# EAGLE design passion-v2-1 (EAGLE 9.6.2)
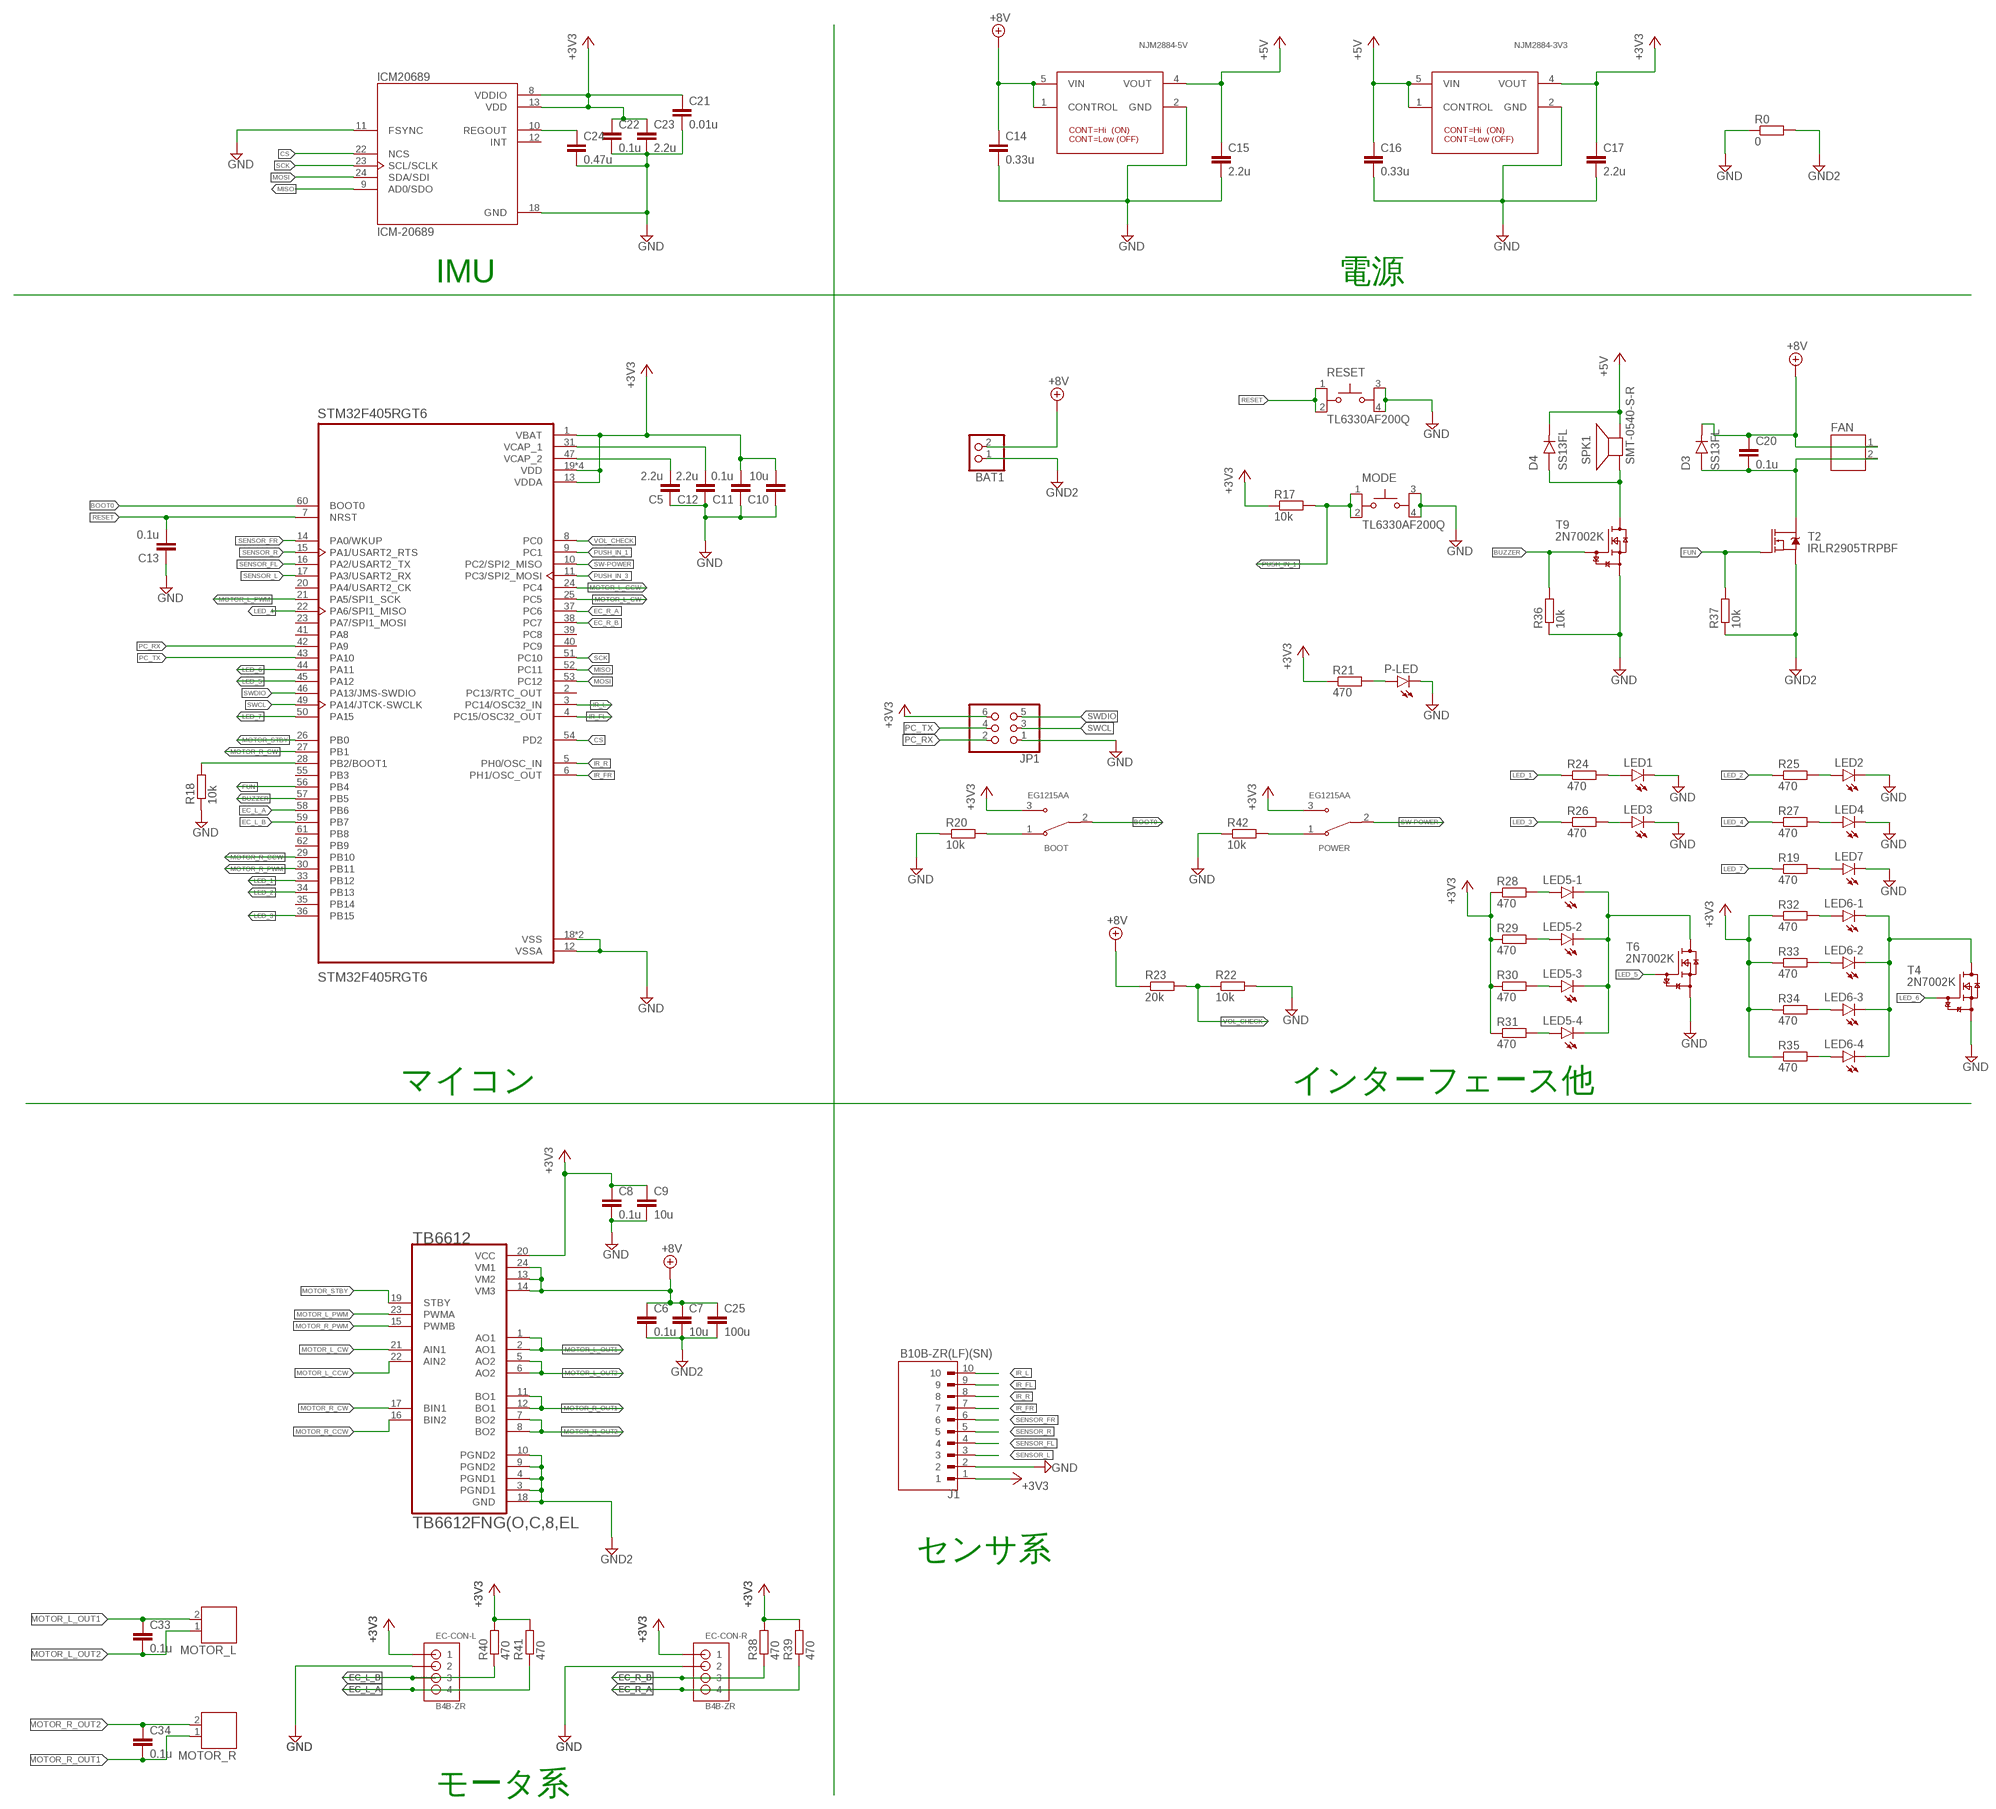
[diagram p0: schematic, sheet 1]

## Parts
BAT1  PINHD-1X2  [1X02]
BOOT  EG1215AA  [SW_EG1215AA]
C5  2.2u  C-EUC0603  [C0603]
C6  0.1u  C-EUC0603  [C0603]
C7  10u  C-EUC0603  [C0603]
C8  0.1u  C-EUC0603  [C0603]
C9  10u  C-EUC0603K  [C0603K]
C10  10u  C-EUC0603  [C0603]
C11  0.1u  C-EUC0603  [C0603]
C12  2.2u  C-EUC0603  [C0603]
C13  0.1u  C-EUC0603  [C0603]
C14  0.33u  C-EUC0603  [C0603]
C15  2.2u  C-EUC0603  [C0603]
C16  0.33u  C-EUC0603  [C0603]
C17  2.2u  C-EUC0603  [C0603]
C20  0.1u  C-EUC0603  [C0603]
C21  0.01u  C-EUC0603  [C0603]
C22  0.1u  C-EUC0603  [C0603]
C23  2.2u  C-EUC0603  [C0603]
C24  0.47u  C-EUC0603  [C0603]
C25  100u  C-EUC3216  [C3216]
C33  0.1u  C-EUC0603  [C0603]
C34  0.1u  C-EUC0603  [C0603]
D3  SS13FL  [SODFL3617X108N]
D4  SS13FL  [SODFL3617X108N]
EC-CON-L  B4B-ZR  [B4B-ZR]
EC-CON-R  B4B-ZR  [B4B-ZR]
FAN  JST-PH2  [JST-PH2]
ICM20689  ICM-20689  [QFN50P400X400X95-24N]
J1  B10B-ZR(LF)(SN)  [JST_B10B-ZR(LF)(SN)]
JP1  PINHD-2X3  [2X03]
LED1  LEDCHIPLED_0603  [CHIPLED_0603]
LED2  LEDCHIPLED_0603  [CHIPLED_0603]
LED3  LEDCHIPLED_0603  [CHIPLED_0603]
LED4  LEDCHIPLED_0603  [CHIPLED_0603]
LED5-1  LEDCHIPLED_0603  [CHIPLED_0603]
LED5-2  LEDCHIPLED_0603  [CHIPLED_0603]
LED5-3  LEDCHIPLED_0603  [CHIPLED_0603]
LED5-4  LEDCHIPLED_0603  [CHIPLED_0603]
LED6-1  LEDCHIPLED_0603  [CHIPLED_0603]
LED6-2  LEDCHIPLED_0603  [CHIPLED_0603]
LED6-3  LEDCHIPLED_0603  [CHIPLED_0603]
LED6-4  LEDCHIPLED_0603  [CHIPLED_0603]
LED7  LEDCHIPLED_0603  [CHIPLED_0603]
MODE  TL6330AF200Q  [SW_TL6330AF200Q]
MOTOR_L  JST-PH2  [JST-PH2]
MOTOR_R  JST-PH2  [JST-PH2]
NJM2884-3V3  I-10673_NJM2884U1-33  [NJM2884U1-33]
NJM2884-5V  I-10673_NJM2884U1-33  [NJM2884U1-33]
P-LED  LEDCHIPLED_0603  [CHIPLED_0603]
POWER  EG1215AA  [SW_EG1215AA]
R0  0  R-EU_R0603  [R0603]
R17  10k  R-EU_R0603  [R0603]
R18  10k  R-EU_R0603  [R0603]
R19  470  R-EU_R0603  [R0603]
R20  10k  R-EU_R0603  [R0603]
R21  470  R-EU_R0603  [R0603]
R22  10k  R-EU_R0603  [R0603]
R23  20k  R-EU_R0603  [R0603]
R24  470  R-EU_R0603  [R0603]
R25  470  R-EU_R0603  [R0603]
R26  470  R-EU_R0603  [R0603]
R27  470  R-EU_R0603  [R0603]
R28  470  R-EU_R0603  [R0603]
R29  470  R-EU_R0603  [R0603]
R30  470  R-EU_R0603  [R0603]
R31  470  R-EU_R0603  [R0603]
R32  470  R-EU_R0603  [R0603]
R33  470  R-EU_R0603  [R0603]
R34  470  R-EU_R0603  [R0603]
R35  470  R-EU_R0603  [R0603]
R36  10k  R-EU_R0603  [R0603]
R37  10k  R-EU_R0603  [R0603]
R38  470  R-EU_R0402  [R0402]
R39  470  R-EU_R0402  [R0402]
R40  470  R-EU_R0402  [R0402]
R41  470  R-EU_R0402  [R0402]
R42  10k  R-EU_R0603  [R0603]
RESET  TL6330AF200Q  [SW_TL6330AF200Q]
SPK1  SMT-0540-S-R  [SMT-0540-S-R]
STM32F405RGT6  STM32F405RGT6  [QFP50P1200X1200X160-64N]
T2  IRLR2905TRPBF  [TO252-3]
T4  2N7002K  [SOT23]
T6  2N7002K  [SOT23]
T9  2N7002K  [SOT23]
TB6612  TB6612FNG(O,C,8,EL  [SOP65P760X160-24N]

## Nets
+3V3 [power]: BOOT.3 C8.1 C9.1 C10.2 C11.2 C17.1 C21.1 C22.1 C23.1 EC-CON-L.1 EC-CON-R.1 ICM20689.8(VDDIO) ICM20689.13(VDD) J1.1 JP1.6 NJM2884-3V3.4(VOUT) POWER.3 R17.1 R21.1 R28.1 R29.1 R30.1 R31.1 R32.1 R33.1 R34.1 R35.1 R38.2 R39.2 R40.2 R41.2 STM32F405RGT6.1(VBAT) STM32F405RGT6.13(VDDA) STM32F405RGT6.19(VDD) STM32F405RGT6.32(VDD) STM32F405RGT6.48(VDD) STM32F405RGT6.64(VDD) TB6612.20(VCC)
+5V [power]: C15.1 C16.1 D4.C NJM2884-3V3.1(CONTROL) NJM2884-3V3.5(VIN) NJM2884-5V.4(VOUT) SPK1.+(-)
+8V [motor]: BAT1.2 C6.1 C7.1 C14.1 C20.1 C25.1 D3.C FAN.1 NJM2884-5V.1(CONTROL) NJM2884-5V.5(VIN) R23.1 TB6612.13(VM2) TB6612.14(VM3) TB6612.24(VM1)
BOOT0: BOOT.2 STM32F405RGT6.60(BOOT0)
BUZZER: R36.2 STM32F405RGT6.57(PB5) T9.1(G)
CS: ICM20689.22(NCS) STM32F405RGT6.54(PD2)
EC_L_A: EC-CON-L.4 R41.1 STM32F405RGT6.58(PB6)
EC_L_B: EC-CON-L.3 R40.1 STM32F405RGT6.59(PB7)
EC_R_A: EC-CON-R.4 R39.1 STM32F405RGT6.37(PC6)
EC_R_B: EC-CON-R.3 R38.1 STM32F405RGT6.38(PC7)
FUN: R37.2 STM32F405RGT6.56(PB4) T2.1(G)
GND [motor]: C5.1 C8.2 C9.2 C10.1 C11.1 C12.1 C13.1 C14.2 C15.2 C16.2 C17.2 C21.2 C22.2 C23.2 C24.2 EC-CON-L.2 EC-CON-R.2 ICM20689.11(FSYNC) ICM20689.18(GND) J1.2 JP1.1 LED1.C LED2.C LED3.C LED4.C LED7.C MODE.3 MODE.4 NJM2884-3V3.2(GND) NJM2884-5V.2(GND) P-LED.C R0.1 R18.1 R20.1 R22.2 R36.1 R42.1 RESET.3 RESET.4 STM32F405RGT6.12(VSSA) STM32F405RGT6.18(VSS) STM32F405RGT6.63(VSS) T4.2(S) T6.2(S) T9.2(S)
GND2 [motor]: BAT1.1 C6.2 C7.2 C25.2 R0.2 R37.1 T2.3(S) TB6612.3(PGND1) TB6612.4(PGND1) TB6612.9(PGND2) TB6612.10(PGND2) TB6612.18(GND)
IR_FL: J1.9 STM32F405RGT6.4(PC15/OSC32_OUT)
IR_FR: J1.7 STM32F405RGT6.6(PH1/OSC_OUT)
IR_L: J1.10 STM32F405RGT6.3(PC14/OSC32_IN)
IR_R: J1.8 STM32F405RGT6.5(PH0/OSC_IN)
LED_1: R24.1 STM32F405RGT6.33(PB12)
LED_2: R25.1 STM32F405RGT6.34(PB13)
LED_3: R26.1 STM32F405RGT6.36(PB15)
LED_4: R27.1 STM32F405RGT6.22(PA6/SPI1_MISO)
LED_5: STM32F405RGT6.45(PA12) T6.1(G)
LED_6: STM32F405RGT6.44(PA11) T4.1(G)
LED_7: R19.1 STM32F405RGT6.50(PA15)
MISO: ICM20689.9(AD0/SDO) STM32F405RGT6.52(PC11)
MOSI: ICM20689.24(SDA/SDI) STM32F405RGT6.53(PC12)
MOTOR_L_CCW: STM32F405RGT6.24(PC4) TB6612.22(AIN2)
MOTOR_L_CW: STM32F405RGT6.25(PC5) TB6612.21(AIN1)
MOTOR_L_OUT1 [motor]: C33.1 MOTOR_L.2 TB6612.1(AO1) TB6612.2(AO1)
MOTOR_L_OUT2 [motor]: C33.2 MOTOR_L.1 TB6612.5(AO2) TB6612.6(AO2)
MOTOR_L_PWM: STM32F405RGT6.21(PA5/SPI1_SCK) TB6612.23(PWMA)
MOTOR_R_CCW: STM32F405RGT6.29(PB10) TB6612.16(BIN2)
MOTOR_R_CW: STM32F405RGT6.27(PB1) TB6612.17(BIN1)
MOTOR_R_OUT1 [motor]: C34.2 MOTOR_R.1 TB6612.11(BO1) TB6612.12(BO1)
MOTOR_R_OUT2 [motor]: C34.1 MOTOR_R.2 TB6612.7(BO2) TB6612.8(BO2)
MOTOR_R_PWM: STM32F405RGT6.30(PB11) TB6612.15(PWMB)
MOTOR_STBY: STM32F405RGT6.26(PB0) TB6612.19(STBY)
N$13: C5.2 STM32F405RGT6.47(VCAP_2)
N$14: C12.2 STM32F405RGT6.31(VCAP_1)
N$15 [motor]: R18.2 STM32F405RGT6.28(PB2/BOOT1)
N$16: LED5-2.A R29.2
N$17: LED5-3.A R30.2
N$18: LED5-4.A R31.2
N$19: BOOT.1 R20.2
N$20: C24.1 ICM20689.10(REGOUT)
N$21: P-LED.A R21.2
N$22: C20.2 D3.A FAN.2 T2.2(D) T2.PAD(D)
N$23: D4.A SPK1.-(+) T9.3(D)
N$26: LED6-2.A R33.2
N$27: LED1.A R24.2
N$28: LED6-3.A R34.2
N$29: LED6-4.A R35.2
N$30: POWER.1 R42.2
N$31: LED4.A R27.2
N$32: LED5-1.A R28.2
N$33: LED7.A R19.2
N$36: LED2.A R25.2
N$38 [motor]: LED6-1.C LED6-2.C LED6-3.C LED6-4.C T4.3(D)
N$39 [motor]: LED5-1.C LED5-2.C LED5-3.C LED5-4.C T6.3(D)
N$41: LED3.A R26.2
N$43: LED6-1.A R32.2
PC_RX: JP1.2 STM32F405RGT6.42(PA9)
PC_TX: JP1.4 STM32F405RGT6.43(PA10)
PUSH_IN_1: MODE.1 MODE.2 R17.2 STM32F405RGT6.9(PC1)
PUSH_IN_3: STM32F405RGT6.11(PC3/SPI2_MOSI)
RESET: C13.2 RESET.1 RESET.2 STM32F405RGT6.7(NRST)
SCK: ICM20689.23(SCL/SCLK) STM32F405RGT6.51(PC10)
SENSOR_FL: J1.4 STM32F405RGT6.16(PA2/USART2_TX)
SENSOR_FR: J1.6 STM32F405RGT6.14(PA0/WKUP)
SENSOR_L: J1.3 STM32F405RGT6.17(PA3/USART2_RX)
SENSOR_R: J1.5 STM32F405RGT6.15(PA1/USART2_RTS)
SW-POWER: POWER.2 STM32F405RGT6.10(PC2/SPI2_MISO)
SWCL: JP1.3 STM32F405RGT6.49(PA14/JTCK-SWCLK)
SWDIO: JP1.5 STM32F405RGT6.46(PA13/JMS-SWDIO)
VOL_CHECK: R22.1 R23.2 STM32F405RGT6.8(PC0)
Unconnected: ICM20689.12(INT) STM32F405RGT6.2(PC13/RTC_OUT) STM32F405RGT6.20(PA4/USART2_CK) STM32F405RGT6.23(PA7/SPI1_MOSI) STM32F405RGT6.35(PB14) STM32F405RGT6.39(PC8) STM32F405RGT6.40(PC9) STM32F405RGT6.41(PA8) STM32F405RGT6.55(PB3) STM32F405RGT6.61(PB8) STM32F405RGT6.62(PB9)

## Notes on the sheet
- IMU | 電源
- マイコン | インターフェース他
- センサ系
- モータ系

## Library data of the parts
BAT1 = pinhead:PINHD-1X2: PIN HEADER
BOOT POWER = EG1215AA:EG1215AA: Slide Switch SPDT Surface Mount, Right Angle Check availability <https://pricing.snapeda.com/parts/EG1215AA/E-Switch/view-part?ref=eda>; AVAILABILITY: In Stock; CHECK_PRICES: https://www.snapeda.com/parts/EG1215AA/E-Switch/view-part/?ref=eda; DESCRIPTION: Slide Switch SPDT Surface Mount, Right Angle; MF: E-Switch; MP: EG1215AA; PACKAGE: None; PRICE: None; PURCHASE-URL: https://www.snapeda.com/api/url_track_click_mouser/?unipart_id=3210616&manufacturer=E-Switch&part_name=EG1215AA&search_term=eg1215aa; SNAPEDA_LINK: https://www.snapeda.com/parts/EG1215AA/E-Switch/view-part/?ref=snap
C5-C17 C20-C25 C33 C34 = rcl:C-EU: CAPACITOR, European symbol; SPICEPREFIX: C
D3 D4 = SS13FL:SS13FL: Diode Schottky Barrier Rectifier 30V 1A 2-Pin SOD-123F T/R Check availability <https://pricing.snapeda.com/parts/SS13FL/ON%20Semiconductor/view-part?ref=eda>; AVAILABILITY: In Stock; CHECK_PRICES: https://www.snapeda.com/parts/SS13FL/Onsemi/view-part/?ref=eda; DESCRIPTION: Diode Schottky 30 V 1A Surface Mount SOD-123F; MF: ON Semiconductor; MP: SS13FL; PACKAGE: SOD-123F ON Semiconductor; PRICE: None; PURCHASE-URL: https://www.snapeda.com/api/url_track_click_mouser/?unipart_id=828962&manufacturer=ON Semiconductor&part_name=SS13FL&search_term=sod-123f; SNAPEDA_LINK: https://www.snapeda.com/parts/SS13FL/Onsemi/view-part/?ref=snap
EC-CON-L EC-CON-R = jst:B4B-ZR: JST-ZH Connector 4 pol, 1.5mm pitch Package: B4B-ZR Source: http://www.jst-mfg.com/product/pdf/eng/eZH.pdf
FAN MOTOR_L MOTOR_R = jst-ph:JST-PH2
ICM20689 = icm-20689:ICM-20689: 6-Axis Drone/Vr/Iot Solution (Pi) Buy Part <https://snapeda.com/parts/ICM-20689/TDK%20InvenSense/view-part/?ref=eda>; AVAILABILITY: Warning; DESCRIPTION: Accelerometer, Gyroscope, Temperature, 6 Axis Sensor I²C, SPI Output; MF: TDK InvenSense; MOUSER-PURCHASE-URL: https://snapeda.com/shop?store=Mouser&id=537724; MP: ICM-20689; PACKAGE: QFN-24 InvenSense; PRICE: None
J1 = B10B-ZR_LF__SN_:B10B-ZR(LF)(SN): Check availability <https://pricing.snapeda.com/parts/B10B-ZR%28LF%29%28SN%29/JST%20Sales%20America%20Inc./view-part?ref=eda>; AVAILABILITY: In Stock; CHECK_PRICES: https://www.snapeda.com/parts/B10B-ZR(LF)(SN)/JST/view-part/?ref=eda; DESCRIPTION: Connector Header Through Hole 10 position 0.059 (1.50mm); MF: JST Sales America Inc.; MP: B10B-ZR(LF)(SN); PACKAGE: None; PRICE: None; SNAPEDA_LINK: https://www.snapeda.com/parts/B10B-ZR(LF)(SN)/JST/view-part/?ref=snap
JP1 = pinhead:PINHD-2X3: PIN HEADER
LED1-LED4 LED5-1-LED5-4 LED6-1-LED6-4 LED7 P-LED = led:LED: LED OSRAM: - CHIPLED LG R971, LG N971, LY N971, LG Q971, LY Q971, LO R971, LY R971 LH N974, LH R974 LS Q976, LO Q976, LY Q976 LO Q996 - Hyper CHIPLED LW Q18S LB Q993, LB Q99A, LB R99A - SideLED LS A670, LO A670, LY A670, LG A670, LP A670 LB A673, LV A673, LT A673, LW A673 LH A674 LY A675 LS A676, LA A676, LO A676, LY A676, LW A676 LS A679, LY A679, LG A679 - Hyper Micro SIDELED® LS Y876, LA Y876, LO Y876, LY Y876 LT Y87S - SmartLED LW L88C, LW L88S LB L89C, LB L89S, LG L890 LS L89K, LO L89K, LY L89K LS L896, LA L896, LO L896, LY L896 - TOPLED LS T670, LO T670, LY T670, LG T670, LP T670 LSG T670, LSP T670, LSY T670, LOP T670, LYG T670 LG T671, LOG T671, LSG T671 LB T673, LV T673, LT T673, LW T673 LH T674 LS T676, LA T676, LO T676, LY T676, LB T676, LH T676, LSB T676, LW T676 LB T67C, LV T67C, LT T67C, LS T67K, LO T67K, LY T67K, LW E67C LS E67B, LA E67B, LO E67B, LY E67B, LB E67C, LV E67C, LT E67C LW T67C LS T679, LY T679, LG T679 LS T770, LO T770, LY T770, LG T770, LP T770 LB T773, LV T773, LT T773, LW T773 LH T774 LS E675, LA E675, LY E675, LS T675 LS T776, LA T776, LO T776, LY T776, LB T776 LHGB T686 LT T68C, LB T68C - Hyper Mini TOPLED® LB M676 - Mini TOPLED Santana® LG M470 LS M47K, LO M47K, LY M47K Source: http://www.osram.convergy.de LUXEON: - LUMILED® LXK2-PW12-R00, LXK2-PW12-S00, LXK2-PW14-U00, LXK2-PW14-V00 LXK2-PM12-R00, LXK2-PM12-S00, LXK2-PM14-U00 LXK2-PE12-Q00, LXK2-PE12-R00, LXK2-PE12-S00, LXK2-PE14-T00, LXK2-PE14-U00 LXK2-PB12-K00, LXK2-PB12-L00, LXK2-PB12-M00, LXK2-PB14-N00, LXK2-PB14-P00, LXK2-PB14-Q00 LXK2-PR12-L00, LXK2-PR12-M00, LXK2-PR14-Q00, LXK2-PR14-R00 LXK2-PD12-Q00, LXK2-PD12-R00, LXK2-PD12-S00 LXK2-PH12-R00, LXK2-PH12-S00 LXK2-PL12-P00, LXK2-PL12-Q00, LXK2-PL12-R00 Source: www.luxeon.com KINGBRIGHT: KA-3528ASYC Source: www.kingbright.com
MODE RESET = TL6330AF200Q:TL6330AF200Q: Check availability <https://pricing.snapeda.com/parts/TL6330AF200Q/E-Switch/view-part?ref=eda>; AVAILABILITY: In Stock; CHECK_PRICES: https://www.snapeda.com/parts/TL6330AF200Q/E-Switch/view-part/?ref=eda; DESCRIPTION: Tactile Switch SPST-NO Top Actuated Surface Mount; MF: E-Switch; MP: TL6330AF200Q; PACKAGE: None; PRICE: None; PURCHASE-URL: https://www.snapeda.com/api/url_track_click_mouser/?unipart_id=2720563&manufacturer=E-Switch&part_name=TL6330AF200Q&search_term=tl6330af200q; SNAPEDA_LINK: https://www.snapeda.com/parts/TL6330AF200Q/E-Switch/view-part/?ref=snap
NJM2884-3V3 NJM2884-5V = Akizuki:I-10673_NJM2884U1-33
R0 R17-R42 = rcl:R-EU_: RESISTOR, European symbol; SPICEPREFIX: R
SPK1 = SMT-0540-S-R:SMT-0540-S-R: SMT-0549-S-R Small surface-mount magnetic buzzer; DESCRIPTION: Buzzers Transducer, Externally Driven Electromechanical/Magnetic 3V 100mA 4kHz 78dB @ 3V, 10cm Surface Mount Solder Pads; DIGI-KEY_PART_NUMBER: 668-1060-1-ND; MF: PUI; MP: SMT-0540-S-R; PACKAGE: PUI; PURCHASE-URL: https://pricing.snapeda.com/search/part/SMT-0540-S-R/?ref=eda
STM32F405RGT6 = stm32_f405rgt6:STM32F405RGT6: High-performance foundation line, ARM Cortex-M4 core with DSP and FPU, 1 Mbyte Flash, 168 MHz CPU, ART Accelerator; AVAILABILITY: Unavailable; DESCRIPTION: ARM® Cortex®-M4 STM32F4 Microcontroller IC 32-Bit 168MHz 1MB (1M x 8) FLASH 64-LQFP (10x10); MF: STMicroelectronics; MP: STM32F405RGT6; PACKAGE: LQFP-64 STMicroelectronics; PRICE: None
T2 = IRLR2905TRPBF:IRLR2905TRPBF: Check availability <https://pricing.snapeda.com/parts/IRLR2905TRPBF/Infineon%20Technologies/view-part?ref=eda>; AVAILABILITY: In Stock; CHECK_PRICES: https://www.snapeda.com/parts/IRLR2905TRPBF/Infineon+Technologies/view-part/?ref=eda; DESCRIPTION: MOSFET, Power,N-Ch,VDSS 55V,RDS(ON) 0.027Ohm,ID 42A,D-Pak (TO-252AA),PD 110W | Infineon IRLR2905TRPBF; MF: Infineon Technologies; MP: IRLR2905TRPBF; PACKAGE: TO-252 Infineon; PRICE: None; PURCHASE-URL: https://www.snapeda.com/api/url_track_click_mouser/?unipart_id=836333&manufacturer=Infineon Technologies&part_name=IRLR2905TRPBF&search_term=mosfet to-252 n-ch; SNAPEDA_LINK: https://www.snapeda.com/parts/IRLR2905TRPBF/Infineon+Technologies/view-part/?ref=snap
T4 T6 T9 = nxp_60:2N7002K: N-channel TrenchMOS FET N-channel enhancement mode Field-Effect Transistor (FET) in a plastic package using TrenchMOS technology. AAL Eindhoven MK
TB6612 = tb6612fng:TB6612FNG(O,C,8,EL: Stepping Motor Driver Ic Unipolor Copper Wire 8" Buy Part <https://snapeda.com/parts/TB6612FNG%28O%2CC%2C8%2CEL/Toshiba/view-part/?ref=eda>; AVAILABILITY: Warning; DESCRIPTION: Motor Driver Power MOSFET Parallel 24-SSOP; MF: Toshiba; MP: TB6612FNG(O,C,8,EL; PACKAGE: SSOP-24 Toshiba; PRICE: None

## Net classes
1 power: width 0.152 mm, clearance 0.205 mm to class 0, clearance 0.205 mm
2 motor: width 0.152 mm, clearance 0.205 mm to class 0, clearance 0.205 mm to class 1, clearance 0.205 mm

## Board
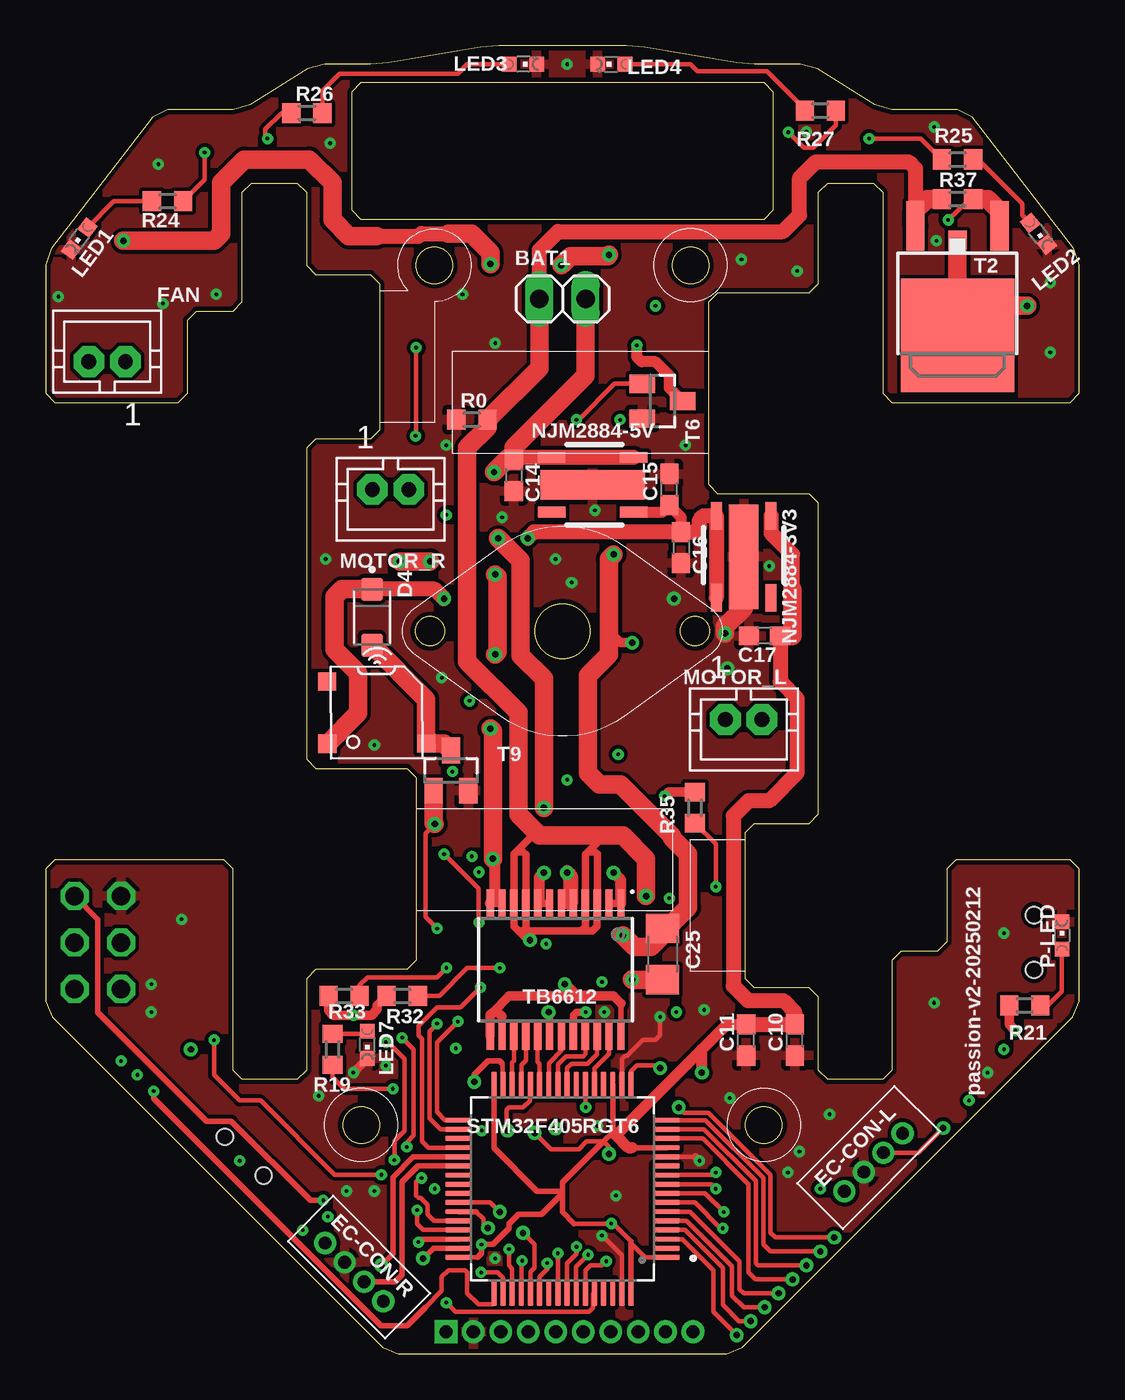
[diagram p1: board, top side]
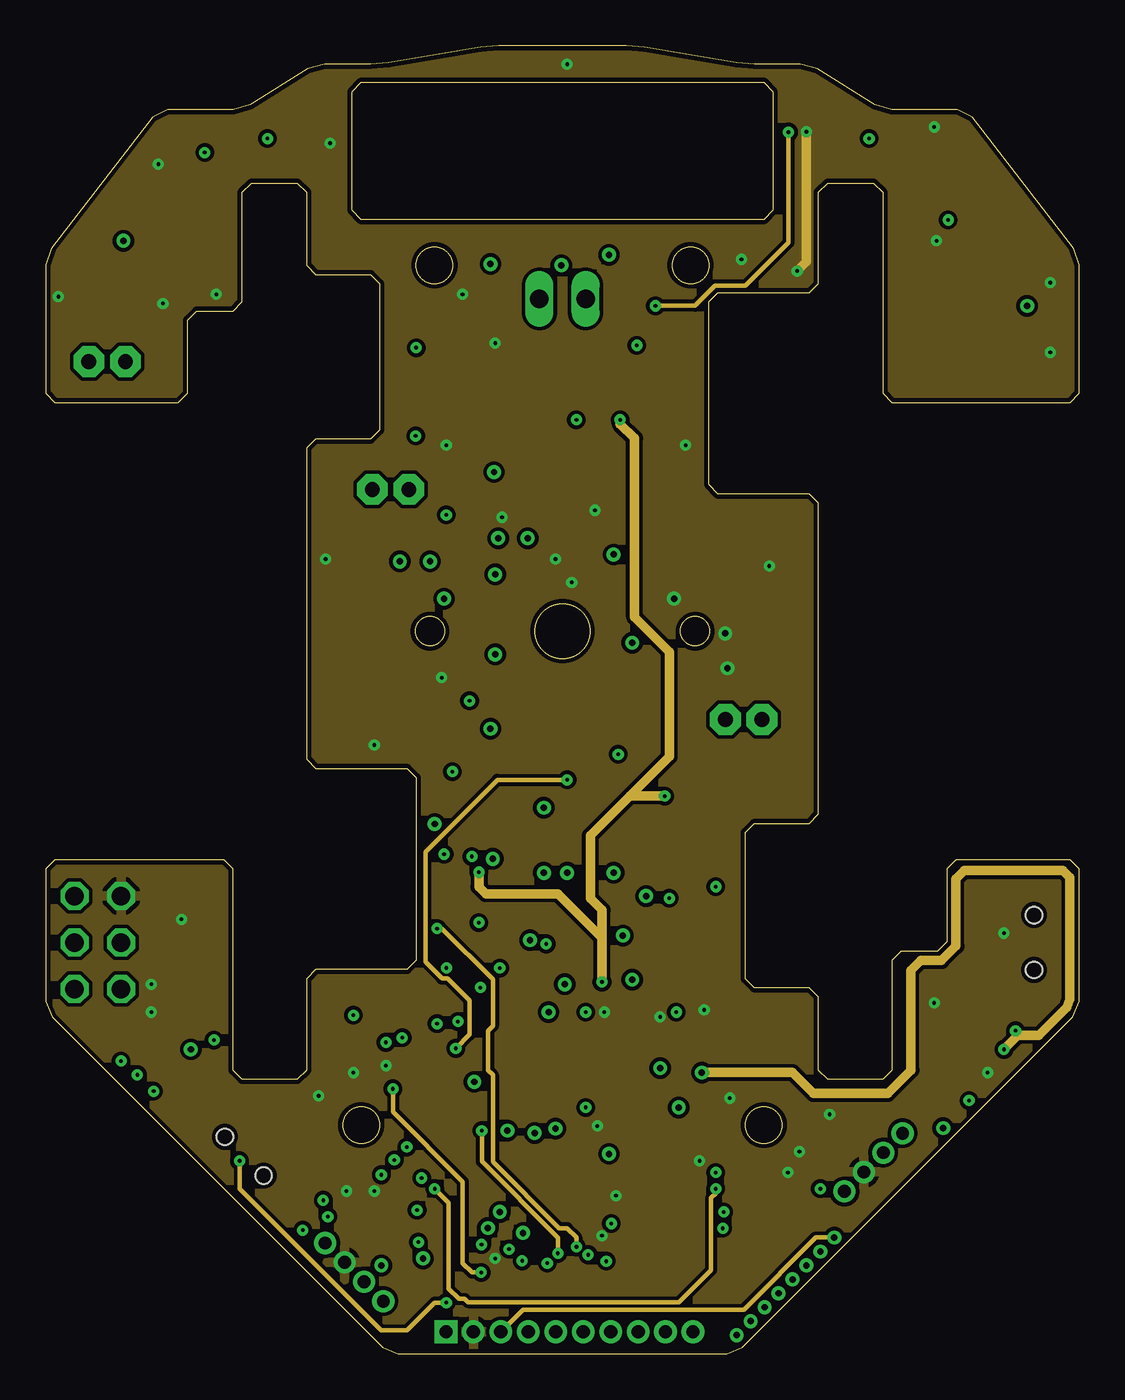
[diagram p2: board, inner layer Route2]
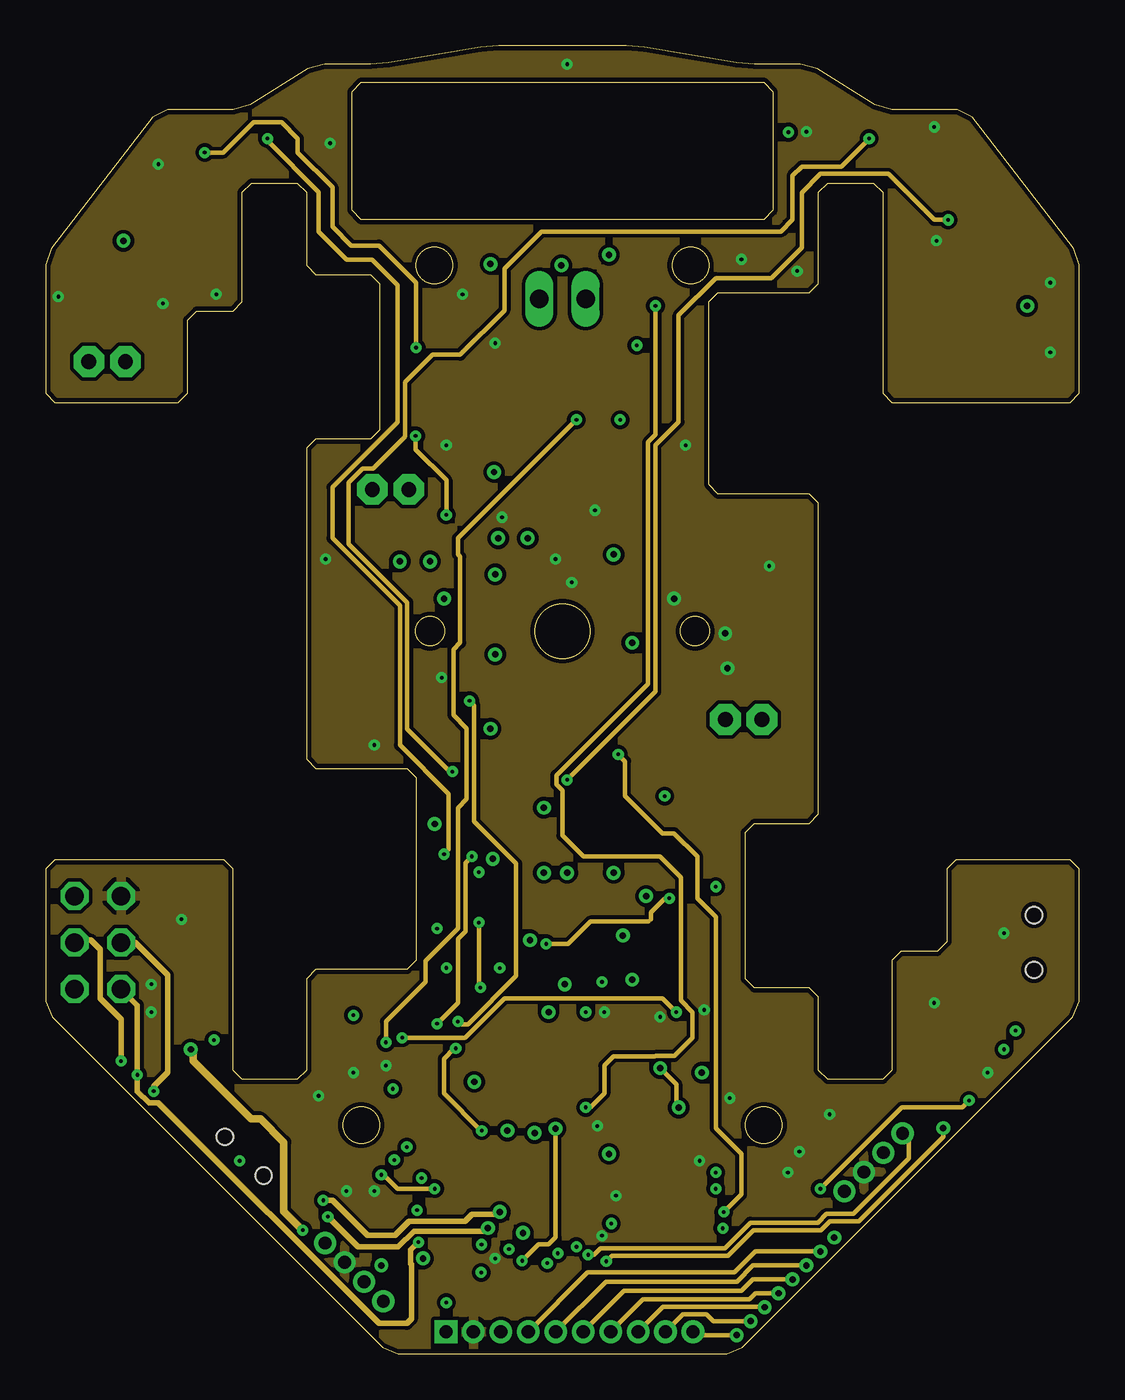
[diagram p3: board, inner layer Route15]
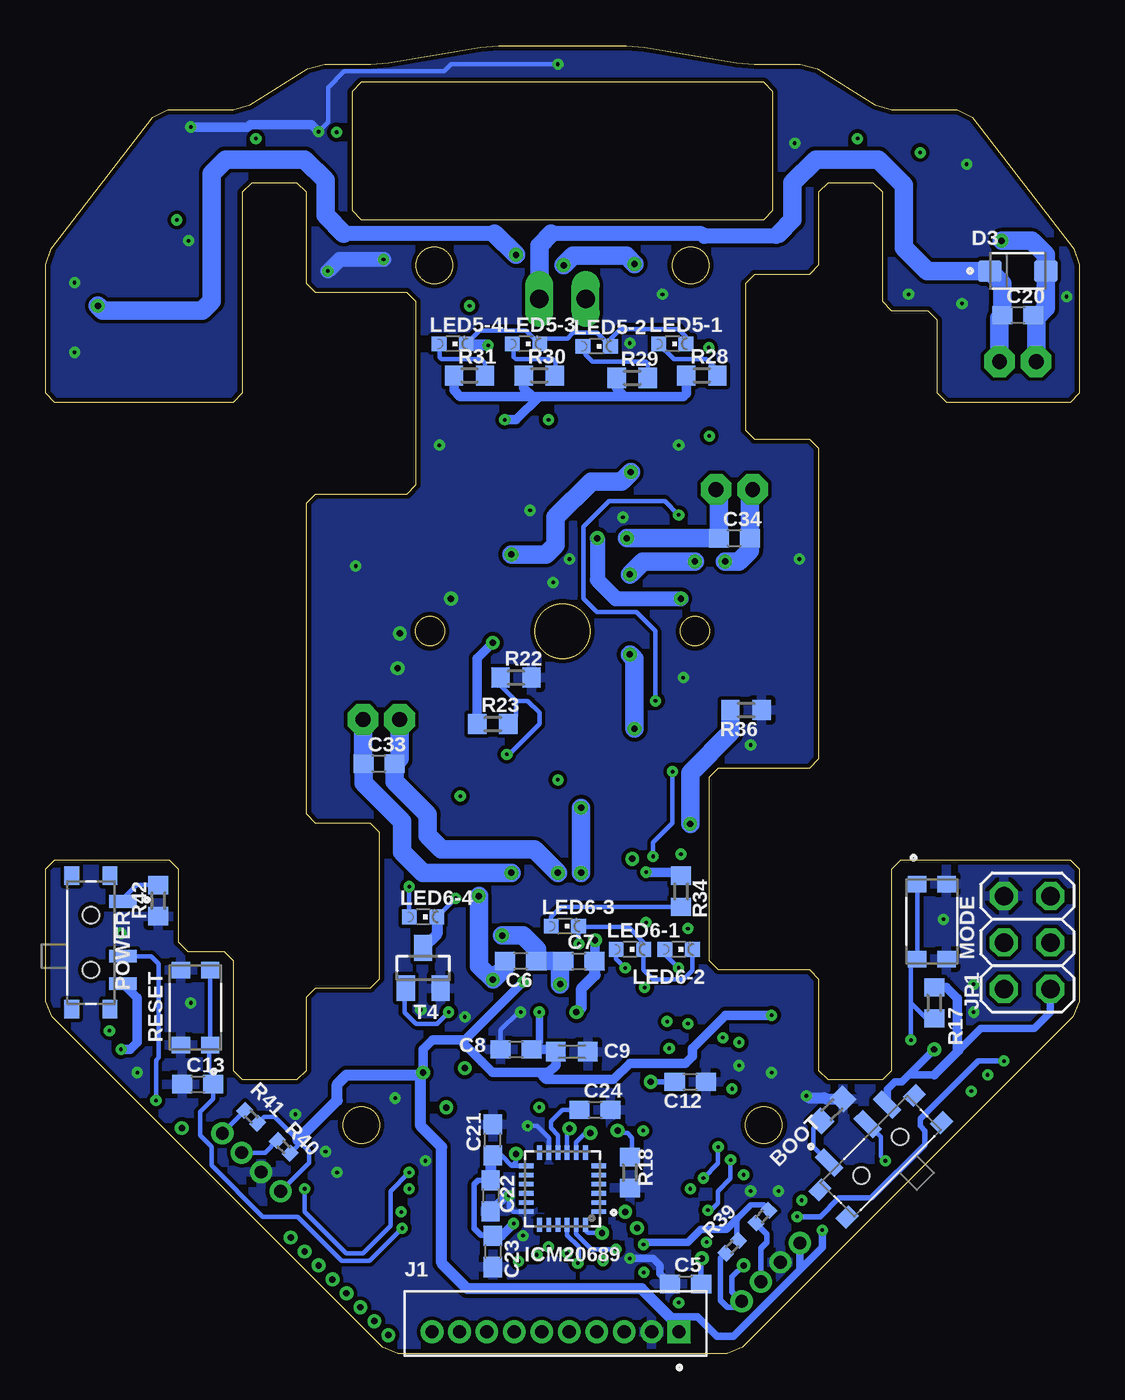
[diagram p4: board, bottom side, seen from below]

Size 56.5 x 71.5 mm. Coordinates in mm from the lower left corner, seen from the top.
Outline: 42.25,46.5 41.75,47 36.75,47 36.25,47.5 36.25,57.5 36.75,58 41.75,58 42.25,58.5 42.25,63.5 42.75,64 45.25,64 45.75,63.5 45.75,52.5 46.25,52 56,52 56.5,52.5 56.5,59.52 56.19,60.42 50.64,67.6 49.84,68 46.25,68 45.33,68.27 42.17,70.23 41.25,70.5 38.75,70.5 37.76,70.58 32.74,71.42 31.75,71.5 24.75,71.5 23.76,71.42 18.74,70.58 17.75,70.5 15.25,70.5 14.33,70.23 11.17,68.27 10.25,68 6.66,68 5.86,67.6 0.31,60.42 0,59.52 0,52.5 0.5,52 7.25,52 7.75,52.5 7.75,56.5 8.25,57 10.25,57 10.75,57.5 10.75,63.5 11.25,64 13.75,64 14.25,63.5 14.25,59.5 14.75,59 17.75,59 18.25,58.5 18.25,50.5 17.75,50 14.75,50 14.25,49.5 14.25,32.5 14.75,32 19.75,32 20.25,31.5 20.25,21.5 19.75,21 14.75,21 14.25,20.5 14.25,15.5 13.75,15 10.75,15 10.25,15.5 10.25,26.5 9.75,27 0.5,27 0,26.5 0,19.26 0.35,18.4 18.4,0.35 19.26,0 37.24,0 38.1,0.35 56.15,18.4 56.5,19.26 56.5,26.5 56,27 49.75,27 49.25,26.5 49.25,22.5 48.75,22 46.75,22 46.25,21.5 46.25,15.5 45.75,15 42.75,15 42.25,15.5 42.25,19.5 41.75,20 38.75,20 38.25,20.5 38.25,28.5 38.75,29 41.75,29 42.25,29.5 42.25,46.5
Outline: 17.25,69.5 39.25,69.5 39.75,69 39.75,62.5 39.25,62 17.25,62 16.75,62.5 16.75,69 17.25,69.5
Outline: circle at 35.25,59.5 radius 1
Outline: circle at 21.25,59.5 radius 1
Outline: circle at 35.5,39.5 radius 0.8
Outline: circle at 21,39.5 radius 0.8
Outline: circle at 28.25,39.5 radius 1.5
Outline: circle at 17.25,12.5 radius 1
Outline: circle at 39.25,12.5 radius 1
Copper layers (1+2*15+16): Top 0.035mm / dielectric 1.5mm / Route2 0.035mm / dielectric 0.15mm / Route15 0.035mm / dielectric 0.2mm / Bottom 0.035mm
Design rules "default *": minimum track width 6mil, minimum drill 0.2mm, track to track 6mil, track to pad 6mil, pad to pad 6mil, via to via 6mil, smd to smd 6mil, copper to edge 10mil, drill to drill 6mil, minimum pad ring 10mil, minimum via ring 8mil, stop-mask expansion 4mil, vias tented up to drill 100mil, thermal gap 10mil

### Footprints (pad centres in the part's own frame; a part is rotated, then mirrored left to right if it is on the bottom)
1X02 = drill 1.016 long: 1 -1.27,0; 2 1.27,0
SW_EG1215AA = smd 0.7 x 1.5: 1 -2.25,1.75; 2 0.75,1.75; 3 2.25,1.75 | smd 1 x 0.8: S1 -3.65,1.05; S2 -3.65,-1.05; S3 3.65,-1.05; S4 3.65,1.05 | hole 0.9: -1.5,0; 1.5,0
C0603 = smd 1.1 x 1: 1 -0.85,0; 2 0.85,0
C0603K = smd 1.05 x 1.08: 1 -0.875,0; 2 0.875,0
C3216 = smd 1.6 x 1.8: 1 -1.4,0; 2 1.4,0
SODFL3617X108N = smd 1.25 x 1.16: A 1.53,0; C -1.53,0
B4B-ZR = drill 0.7: 1 6,-1.3; 2 4.5,-1.3; 3 3,-1.3; 4 1.5,-1.3
JST-PH2 = drill 0.813 pad 1.676 octagon: 1 1,0; 2 -1,0
QFN50P400X400X95-24N = smd 0.79 x 0.26: 1 -1.97,1.25; 2 -1.97,0.75; 3 -1.97,0.25; 4 -1.97,-0.25; 5 -1.97,-0.75; 6 -1.97,-1.25; 13 1.97,-1.25; 14 1.97,-0.75; 15 1.97,-0.25; 16 1.97,0.25; 17 1.97,0.75; 18 1.97,1.25 | smd 0.26 x 0.79: 7 -1.25,-1.97; 8 -0.75,-1.97; 9 -0.25,-1.97; 10 0.25,-1.97; 11 0.75,-1.97; 12 1.25,-1.97; 19 1.25,1.97; 20 0.75,1.97; 21 0.25,1.97; 22 -0.25,1.97; 23 -0.75,1.97; 24 -1.25,1.97
JST_B10B-ZR(LF)(SN) = drill 0.73 square: 1 6.75,-0.45 | drill 0.73: 2 5.25,-0.45; 3 3.75,-0.45; 4 2.25,-0.45; 5 0.75,-0.45; 6 -0.75,-0.45; 7 -2.25,-0.45; 8 -3.75,-0.45; 9 -5.25,-0.45; 10 -6.75,-0.45
2X03 = drill 1.016 octagon: 1 -2.54,-1.27; 2 -2.54,1.27; 3 0,-1.27; 4 0,1.27; 5 2.54,-1.27; 6 2.54,1.27
CHIPLED_0603 = smd 0.8 x 0.8: A 0,-0.75; C 0,0.75
SW_TL6330AF200Q = smd 0.9 x 1: 1 -2.05,-0.8; 2 2.05,-0.8; 3 -2.05,0.8; 4 2.05,0.8
NJM2884U1-33 = smd 0.6 x 1.5: 1 -1.5,-2.25; 3 1.5,-2.25; 4 1.5,2.25; 5 -1.5,2.25 | smd 1.6 x 5.7: 2 0,0
R0603 = smd 1 x 1.1: 1 -0.85,0; 2 0.85,0
R0402 = smd 0.6 x 0.7: 1 -0.5,0; 2 0.5,0
SMT-0540-S-R = smd 1 x 1: + 1.7,-2.7; - 1.7,2.7; M -1.7,-2.7
QFP50P1200X1200X160-64N = smd 1.47 x 0.28: 1 -5.67,3.75; 2 -5.67,3.25; 3 -5.67,2.75; 4 -5.67,2.25; 5 -5.67,1.75; 6 -5.67,1.25; 7 -5.67,0.75; 8 -5.67,0.25; 9 -5.67,-0.25; 10 -5.67,-0.75; 11 -5.67,-1.25; 12 -5.67,-1.75; 13 -5.67,-2.25; 14 -5.67,-2.75; 15 -5.67,-3.25; 16 -5.67,-3.75; 33 5.67,-3.75; 34 5.67,-3.25; 35 5.67,-2.75; 36 5.67,-2.25; 37 5.67,-1.75; 38 5.67,-1.25; 39 5.67,-0.75; 40 5.67,-0.25; 41 5.67,0.25; 42 5.67,0.75; 43 5.67,1.25; 44 5.67,1.75; 45 5.67,2.25; 46 5.67,2.75; 47 5.67,3.25; 48 5.67,3.75 | smd 0.28 x 1.47: 17 -3.75,-5.67; 18 -3.25,-5.67; 19 -2.75,-5.67; 20 -2.25,-5.67; 21 -1.75,-5.67; 22 -1.25,-5.67; 23 -0.75,-5.67; 24 -0.25,-5.67; 25 0.25,-5.67; 26 0.75,-5.67; 27 1.25,-5.67; 28 1.75,-5.67; 29 2.25,-5.67; 30 2.75,-5.67; 31 3.25,-5.67; 32 3.75,-5.67; 49 3.75,5.67; 50 3.25,5.67; 51 2.75,5.67; 52 2.25,5.67; 53 1.75,5.67; 54 1.25,5.67; 55 0.75,5.67; 56 0.25,5.67; 57 -0.25,5.67; 58 -0.75,5.67; 59 -1.25,5.67; 60 -1.75,5.67; 61 -2.25,5.67; 62 -2.75,5.67; 63 -3.25,5.67; 64 -3.75,5.67
TO252-3 = smd 1 x 2.7: 1 -2.3,-4.25; 3 2.3,-4.25 | smd 1 x 1.02: 2 0,-3.48 | smd 6.2 x 6.2: PAD 0,1.75
SOT23 = smd 1 x 1.4: 1 -0.95,-1.1; 2 0.95,-1.1; 3 0,1.1
SOP65P760X160-24N = smd 1.5 x 0.4: 1 -3.625,3.575; 2 -3.625,2.925; 3 -3.625,2.275; 4 -3.625,1.625; 5 -3.625,0.975; 6 -3.625,0.325; 7 -3.625,-0.325; 8 -3.625,-0.975; 9 -3.625,-1.625; 10 -3.625,-2.275; 11 -3.625,-2.925; 12 -3.625,-3.575; 13 3.625,-3.575; 14 3.625,-2.925; 15 3.625,-2.275; 16 3.625,-1.625; 17 3.625,-0.975; 18 3.625,-0.325; 19 3.625,0.325; 20 3.625,0.975; 21 3.625,1.625; 22 3.625,2.275; 23 3.625,2.925; 24 3.625,3.575

### Placement (x,y rotation side)
BAT1  28.25,57.66 0 top
BOOT  10.85,10.8 45 bottom
C5  21.52,3.81 0 bottom
C6  30.54,21.47 180 bottom
C7  27.36,21.47 0 bottom
C8  30.79,16.64 180 bottom
C9  27.74,16.51 0 bottom
C10  40.95,17.15 90 top
C11  38.28,17.15 90 top
C12  21.27,14.86 180 bottom
C13  48.19,14.73 0 bottom
C14  25.58,48.01 270 top
C15  34.09,47.25 90 top
C16  34.73,44.07 270 top
C17  39.3,39.25 180 top
C20  3.36,56.77 0 bottom
C21  32.06,11.69 90 bottom
C22  32.19,8.64 270 bottom
C23  32.06,5.59 270 bottom
C24  26.47,13.34 0 bottom
C25  33.71,21.85 270 top
C33  38.28,32.26 0 bottom
C34  18.85,44.58 0 bottom
D3  3.36,59.19 0 bottom
D4  17.84,40.26 270 top
EC-CON-L  48.82,12.2 225 top
EC-CON-R  18.6,0.89 135 top
FAN  3.36,54.23 0 top
ICM20689  28.25,9.02 180 bottom
J1  28.63,1.65 0 bottom
JP1  2.85,22.48 270 bottom
LED1  1.83,60.96 143.2 top
LED2  54.28,61.22 218.1 top
LED3  26.09,70.49 270 top
LED4  30.92,70.49 90 top
LED5-1  22.25,55.2 270 bottom
LED5-2  26.38,55.07 270 bottom
LED5-3  30.25,55.2 270 bottom
LED5-4  34.25,55.2 270 bottom
LED6-1  24.57,22.1 270 bottom
LED6-2  21.9,22.1 270 bottom
LED6-3  28.12,23.37 270 bottom
LED6-4  35.87,23.88 270 bottom
LED7  17.58,16.89 180 top
MODE  8.06,23.62 270 bottom
MOTOR_L  38.16,34.67 180 top
MOTOR_R  18.85,47.25 180 top
NJM2884-3V3  38.16,43.56 0 top
NJM2884-5V  29.9,47.5 270 top
P-LED  55.55,22.86 0 top
POWER  54.03,22.48 270 bottom
R0  23.3,51.06 0 top
R17  7.93,19.18 270 bottom
R18  24.57,9.91 90 bottom
R19  15.68,16.64 90 top
R20  13.52,13.34 225 bottom
R21  53.52,19.05 0 top
R22  30.79,36.96 0 bottom
R23  32.06,34.42 0 bottom
R24  6.66,63 180 top
R25  49.84,65.28 0 top
R26  14.28,67.82 0 top
R27  42.35,67.95 180 top
R28  20.63,53.47 0 bottom
R29  24.44,53.34 0 bottom
R30  29.52,53.47 0 bottom
R31  33.33,53.47 0 bottom
R32  19.49,19.56 0 top
R33  16.31,19.56 0 top
R34  21.77,25.28 270 bottom
R35  35.49,29.85 270 top
R36  18.22,35.18 180 bottom
R37  49.84,63.12 0 top
R38  17.33,7.5 45 bottom
R39  18.98,5.84 45 bottom
R40  43.49,11.31 315 bottom
R41  45.27,12.96 315 bottom
R42  50.35,24.77 90 bottom
RESET  48.32,18.93 90 bottom
SPK1  18.09,35.05 270.2 top
STM32F405RGT6  28.25,9.02 180 top
T2  49.84,57.41 180 top
T4  35.87,21.09 0 bottom
T6  33.71,52.07 270 top
T9  22.15,31.88 0 top
TB6612  27.87,21 270 top

### Tracks (layer width: path | path; a pad name or v marks a point on that pad's centre or on a via)
+3V3  (via drill 0.2, 0.35)
  Top 0.254: v26.73,12.07 27.61,11.18 29.14,11.18 29.56,11.6 30.49,11.6 30.79,11.31 v30.79,10.93 | STM32F405RGT6.1 32.76,5.27 32,6.03 32,6.16 31.04,7.12 v30.92,7.12 28.89,7.12 | STM32F405RGT6.48 23.61,5.27
  Top 0.305: 32.06,11.27 STM32F405RGT6.13 | 31,12.11 31.17,11.94 | STM32F405RGT6.64 32,6.16 | STM32F405RGT6.32 24.5,11.25 26.85,8.89 28.25,8.89 | 28.25,8.89 28.25,9.36 30.49,11.6 31,12.11 | 28.25,8.77 27.11,7.62 25.84,7.62 25.33,7.12 25.33,6.86 24.44,5.97 v23.82,5.97 23.82,5.48 23.61,5.27 | 28.25,8.77 28.25,8.89 | 28.25,8.77 28.25,7.75 28.89,7.12 | STM32F405RGT6.19 31,12.11
  Top 0.406: TB6612.20 28.84,18.5 29.01,18.67 v29.52,18.67 | v29.52,18.67
  Top 0.508: R21.1 52.67,18 v53.02,17.66 | R33.1 15.46,18.76 15.72,18.5 v16.82,18.5 16.99,18.5 | R32.1 18.12,19.05 18.12,18.82 17.8,18.5 16.99,18.5 | 16.99,18.5 | v33.84,30.48 34.05,30.7 R35.1
  Top 0.61: 32.06,11.27 31.84,11.27 31.17,11.94 35.87,16.64 | 35.87,16.64 37.23,18 C11.2 | v35.87,15.37 35.87,16.64
  Top 0.813: NJM2884-3V3.4 39.66,44.86 40.82,43.69 40.82,41.79 | C17.1 40.15,36.74 41.08,35.82 41.08,31.75 39.55,30.23 38.41,30.23 37.59,29.41 37.59,20.1 38.38,19.31 40.31,19.31 40.95,18.67 C10.2 C11.2
  Top 1.016: C17.1 40.82,39.25 40.82,41.79
  Route2 0.508: v35.87,15.37 40.82,15.37 41.97,14.23 46.03,14.23 47.3,15.5 47.3,20.96 47.83,21.49 48.96,21.49 49.76,22.29 49.76,25.96 50.22,26.42 55.61,26.42 55.99,26.04 55.99,19.36 55.81,18.93 54.28,17.4 53.27,17.4 | v53.02,17.66 53.27,17.4 | v52.38,16.64 53.14,17.4 53.27,17.4 | v30.41,20.32 30.41,22.74 | v23.68,26.32 23.68,25.53 24.06,25.15 28,25.15 30.41,22.74 | 30.41,22.74 30.41,24.26 29.77,24.89 29.77,28.32 31.93,30.48 | v33.84,30.48 31.93,30.48 | 31.93,30.48 34.09,32.64 34.09,38.36 32.19,40.26 32.19,50.04 31.4,50.83 v31.4,51.06
  Route15 0.406: v14.05,6.76 13.01,7.8 13.01,11.56 11.74,12.83 11.23,12.83 8.06,16 8.06,16.51 v7.93,16.64
  Bottom 0.254: ICM20689.13 31.02,10.27 | C21.1 31.59,10.84 31.02,10.27 | ICM20689.8 27.5,11.55 26.98,12.07 v26.73,12.07 | 31.02,10.27 30.79,10.5 v30.79,10.93 | R41.2 44.56,12.96 44,12.96 42.73,11.69 | R40.2 42.73,11.36 42.73,11.69 | EC-CON-L.1 42.09,10.44 42.09,11.05 42.73,11.69
  Bottom 0.305: C23.1 32.1,6.48 32.7,6.48 33.08,6.86 33.08,9.27 32.86,9.49 C22.1 | R39.2 18.73,6.3 18.73,7.37 17.96,8.13 17.26,8.13 R38.2
  Bottom 0.406: 18.73,7.37 19.28,6.81 20.67,6.81 21.38,6.1 23.7,6.1 v23.82,5.97 | EC-CON-R.1 15.28,4.6 | 15.28,4.6 18.91,0.96 19.8,0.96 20.88,2.03 22.41,2.03 | 15.28,4.6 14.05,5.82 v14.05,6.76 | 6.6,16.58 5.39,17.78 2.47,17.78 1.58,18.67 JP1.6 | v7.93,16.64 9.33,15.24 | 7.93,15.24 9.33,15.24 | 9.33,15.24 9.71,14.86 10.09,14.86 10.5,14.45 BOOT.3 | C8.1 29.52,17.06 v29.52,18.67
  Bottom 0.508: R28.1 21.48,52.49 21.65,52.33 24.82,52.33 | R29.1 25.29,52.8 24.82,52.33 | 24.82,52.33 29.52,52.33 | 29.52,52.33 29.9,52.33 | R30.1 30.37,52.8 29.9,52.33 | R31.1 34.18,52.67 33.84,52.33 29.9,52.33 | C8.1 28.74,16.64 C9.1 28.62,15.77 29.01,15.37 29.52,15.37 | v35.87,15.37 35.87,16.64 35.36,17.15 33.84,17.15 | 33.84,17.15 32.65,15.96 32.65,15.95 32.07,15.37 29.52,15.37 | POWER.3 51.49,19.44 51.49,17.02 51.87,16.64 v52.38,16.64 | R17.1 7.26,20.03 6.66,19.43 6.66,16.64 6.6,16.58 7.93,15.24 | v16.82,18.5 19.34,18.5 21.14,16.7 21.14,16.26 21.52,15.88 24.57,15.88 25.46,14.99 29.14,14.99 29.52,15.37 | 33.84,17.15 33.58,17.15 v30.41,20.32 | v23.68,26.32 21.97,26.32 R34.1 | 29.52,52.33 30.79,51.06 v31.4,51.06 | v30.92,7.12 31.59,6.44 C23.1
  Bottom 0.61: C21.1 32.19,10.71 C22.1 | 42.73,11.69 40.57,13.85 40.57,14.73 40.06,15.24 36,15.24 | 36,15.24 v35.87,15.37 | 36,15.24 36,12.45 34.85,11.31 34.85,4.96 33.46,3.56 23.93,3.56 22.41,2.03 21.88,1.51 J1.1
+5V  (via drill 0.35)
  Top 0.61: NJM2884-5V.4 33.7,46 C15.1 34.09,46.36 34.73,45.72 C16.1
  Top 0.813: NJM2884-3V3.1 NJM2884-3V3.5 35.96,45.81 35.74,45.6 35.74,45.22 35.45,44.92 C16.1 26.69,44.92 v26.34,44.58 | v21.77,41.28 21.26,41.79 D4.C
  Top 1.016: SPK1.+ 17.07,35.02 17.07,37.21 15.8,38.48 15.8,41.41 16.19,41.79 D4.C
  Bottom 0.813: v26.34,44.58 26.34,42.29 25.33,41.28 v21.77,41.28
+8V  (via drill 0.35)
  Top 0.305: TB6612.14 24.93,18.43 | TB6612.24 31.44,19.14
  Top 0.508: TB6612.13 24.29,18.53 24.44,18.67 | 24.44,18.67 24.69,18.67 24.93,18.43 | 24.44,18.67 25.33,19.56 29.01,19.56 29.14,19.56 | 29.52,19.56 31.04,19.56 31.45,19.15 31.44,19.14 | 30.79,39.5 31.43,38.87 v32.06,38.87
  Top 0.61: v28.38,20.2 29.01,19.56 | 29.14,19.56 29.52,19.56
  Top 0.813: C14.1 25.73,49 NJM2884-5V.1 NJM2884-5V.5
  Top 1.016: v31.55,22.86 32.19,22.23 33.08,22.23 33.71,22.86 C25.1 33.97,23.25 35.11,24.39 35.11,27.32 34.23,28.2 34.23,28.32 31.43,31.12 30.28,31.12 29.65,31.75 29.65,37.09 30.79,38.23 30.79,39.5 30.79,43.44 v31.04,43.69 | BAT1.2 29.52,53.47 25.58,49.53 C14.1 25.74,49.01 25.33,49.01 v24.51,48.19
  Bottom 0.508: v32.06,38.87 32.91,38.02 R23.1
  Bottom 0.813: 16.42,61.24 16.57,61.09 20.5,61.09 20.63,61.22 28.84,61.22 28.86,61.24
  Bottom 1.016: v31.55,22.86 30.41,22.86 29.65,22.1 29.69,22.06 C6.1 C7.1 28.38,21.3 v28.38,20.2 | BAT1.2 29.52,60.58 28.86,61.24 | 16.42,61.24 15.68,61.98 15.68,64.01 14.41,65.28 10.98,65.28 9.58,63.88 9.58,60.45 8.31,59.19 D3.C 4.21,58.5 C20.1 4.36,56.62 FAN.1 | v24.51,48.19 25.02,47.69 26.67,47.69 28.63,45.72 28.63,44.2 29.14,43.69 v31.04,43.69
BOOT0  (via drill 0.2)
  Top 0.254: STM32F405RGT6.60 29.92,3.27 29.92,2.52 29.69,2.29 22.41,2.29 v21.9,2.8
  Route2 0.254: v10.6,10.54 10.6,9.02 18.34,1.27 19.74,1.27 21.27,2.8 v21.9,2.8
  Bottom 0.254: BOOT.2 10.85,11.86 10.85,10.8 v10.6,10.54
BUZZER  (via drill 0.2, 0.35)
  Top 0.254: STM32F405RGT6.57 28.5,4.95 29.01,5.46 v29.01,5.84 | v21.27,28.96 20.76,28.45 20.76,23.88 v21.39,23.24
  Top 1.016: T9.1 21.2,29.02 v21.27,28.96
  Route2 0.254: v29.01,5.84 29.01,6.35 28.5,6.86 28.06,6.86 24.44,10.48 24.44,15.24 24.19,15.5 24.19,17.66 24.44,17.91 24.44,20.45 21.65,23.24 v21.39,23.24
  Bottom 1.016: v21.27,28.96 21.27,31.75 19.07,33.95 R36.2
CS  (via drill 0.2)
  Top 0.254: STM32F405RGT6.54 27,4.21 27.42,4.63 v27.42,4.96
  Bottom 0.254: ICM20689.22 28,6.48 27.36,5.84 27.36,5.01 v27.42,4.96
EC_L_A  (via drill 0.2)
  Top 0.254: v29.65,5.41 29,4.76 STM32F405RGT6.58
  Route15 0.254: EC-CON-L.4 47.17,11.73 47.17,10.67 44.15,7.65 42.69,7.65 42.2,7.17 38.52,7.17 37.12,5.77 30.33,5.77 29.98,5.41 v29.65,5.41
  Bottom 0.254: EC-CON-L.4 45.62,13.28 R41.1
EC_L_B  (via drill 0.2, 0.35)
  Top 0.254: EC-CON-L.3 47.71,10.99 v49.06,12.34 | STM32F405RGT6.59 29.5,4.55 29.77,4.83 30.41,4.83 v30.64,5.06
  Route15 0.254: v49.06,12.34 49.06,11.86 44.45,7.24 42.86,7.24 42.37,6.76 38.69,6.76 37.29,5.36 30.95,5.36 v30.64,5.06
  Bottom 0.254: EC-CON-L.3 44.51,10.99 R40.1
EC_R_A  (via drill 0.35)
  Top 0.305: STM32F405RGT6.37 20.09,10.77 18.98,9.66 18.98,5.46 v18.34,4.83
  Bottom 0.305: v18.34,4.83 18.98,4.19 18.98,3.39 EC-CON-R.4 18.79,2.54 19.23,2.54 19.61,2.92 19.61,5.21 R39.1
EC_R_B
  Top 0.305: EC-CON-R.3 19.1,3.93 19.49,4.32 19.49,9.4 20.36,10.27 STM32F405RGT6.38
  Bottom 0.305: EC-CON-R.3 17.4,5.78 17.07,6.1 17.07,6.53 R38.1
FUN  (via drill 0.2)
  Top 0.254: STM32F405RGT6.56 v28,5.49 | v49.33,61.98 49.59,62.24 49.63,62.24 50.51,63.12 R37.2
  Top 1.016: R37.2 51.49,63.12 52.14,62.47 T2.1
  Route2 0.254: v28,5.49 28,6.35 23.84,10.51 v23.84,12.2 | v22.42,16.69 23.17,17.45 23.17,19.31 21.97,20.51 21.66,20.51 20.76,21.41 20.76,27.44 24.69,31.37 v28.5,31.37
  Route15 0.254: v23.84,12.2 23.8,12.2 21.77,14.23 21.77,16.13 22.33,16.69 v22.42,16.69 | v28.5,31.37 33.33,36.2 33.33,49.66 34.6,50.93 34.6,56.77 36.63,58.8 39.68,58.8 41.33,60.45 41.33,63.48 42.35,64.49 46.05,64.49 48.57,61.98 v49.33,61.98
GND  (via drill 0.2, 0.35)
  Top 0.254: STM32F405RGT6.63 31.5,5.39 30.41,6.48 v30.41,6.45 | STM32F405RGT6.18 31.5,16.11 31.68,16.29 31.78,16.29 32.64,17.15 33.33,17.15 33.58,17.4 v33.58,18.42 | STM32F405RGT6.12 35.52,10.77
  Top 0.406: 35.52,10.77 v35.74,10.54
  Top 0.508: v16.82,15.37 16.82,15.38 LED7.C
  Top 1.016: NJM2884-3V3.2 38.16,40.76 37.14,39.74 v37.14,39.37
  Route2 0.508: v41.59,66.81 41.59,59.69 v41.08,59.19
  Bottom 0.254: v28.5,70.49 34.35,70.49 34.73,70.11 40.19,70.11 41.08,69.22 41.08,67.31 v41.59,66.81 | ICM20689.18 30.94,7.77 31.17,8 v31.17,8.64 | ICM20689.11 29,11.8 29.65,12.45 v30.16,12.45 | C8.2 31.64,17.7 30.66,18.67 v30.54,18.67
  Bottom 0.406: C5.1 22.92,4.36 22.92,4.83 23.3,5.21 v24.57,5.21
  Bottom 0.508: v48.57,67.06 45.46,67.06 45.33,67.19 41.97,67.19 v41.59,66.81 | v31.17,8.64 31.34,8.64 C22.2
  Bottom 0.61: R20.1 13.89,13.94 13.94,13.99 14.8,13.99 v14.91,14.1
  Bottom 0.813: v38.03,59.82 40.44,59.82 v41.08,59.19
  other vias: 0.69,57.79 54.92,54.74 54.92,58.55 30.03,46.1 34.98,49.66 48.7,60.84 21.65,36.96 17.96,33.28 16.44,8.89 21.9,49.66 15.55,66.17 52.38,22.99 48.57,19.18 17.96,8.89 39.55,43.06 36,18.8 24.95,45.72 18.6,15.75 34.35,41.28 37.27,37.47 40.57,9.91 42.86,13.08 37.39,13.97 51.49,15.37 7.42,23.75 5.77,20.2 5.77,18.67 41.2,11.05 15.3,43.44 6.15,65.03 6.41,57.41 9.33,57.91 22.79,57.91 28.76,42.17 27.87,43.44 24.57,55.25
  pour Top: 28.25,75.06 7.93,75.06 -7.31,59.82 -7.31,19.18 14.28,-2.41 15.55,-3.68 47.3,-3.68 62.54,11.56 62.54,30.61 62.54,59.82 47.3,75.06
  pour Route2: 26.98,81.41 6.66,81.41 -14.93,59.82 -14.93,17.91 -11.12,14.1 11.74,-8.76 23.17,-8.76 49.84,-8.76 66.35,7.75 70.16,11.56 70.16,62.36 51.11,81.41
  pour Route15: 25.71,87.76 5.39,87.76 -23.82,58.55 -23.82,19.18 -14.93,10.29 10.47,-15.11 52.38,-15.11 76.51,9.02 76.51,64.9 76.51,68.71 57.46,87.76
  pour Bottom: 28.25,94.11 4.12,94.11 -35.25,54.74 -35.25,21.72 10.47,-24 62.54,-24 66.35,-20.19 85.4,-1.14 85.4,67.44 85.4,81.41 71.43,95.38 29.52,95.38
GND2  (via drill 0.35)
  Top 0.406: 25.84,23.12 25.59,23.36 TB6612.10 25.59,27.32 25.71,27.44 | 26.09,23.12 25.84,23.12 | 26.09,23.12 26.24,23.27 TB6612.9 26.24,27.28 26.09,27.44 25.71,27.44 | 29.27,23.12 26.09,23.12 | 29.27,23.12 29.49,23.34 TB6612.4 29.49,27.28 29.65,27.44 | 29.27,23.12 29.9,23.12 30.14,23.36 TB6612.3 30.16,24.64 30.16,27.31 30.03,27.44 29.65,27.44 | 25.84,23.12 26.34,22.61 v26.47,22.61 | v27.49,18.67 27.54,18.62 TB6612.18 | 26.98,28.32 26.6,28.32 25.71,27.44 | 29.65,27.44 30.54,28.32
  Top 0.813: BAT1.1 26.98,60.33 27.99,61.34 40.31,61.34 41.2,62.23 41.2,64.27 42.09,65.15 47.17,65.15 47.54,64.79 T2.3
  Top 1.016: C25.2 v32.06,20.45 | v32.82,25.02 32.82,27.05 31.55,28.32 30.54,28.32 26.98,28.32 25.84,29.47 25.84,35.05 23.04,37.85 23.04,49.53 24.15,50.64 R0.2 26.98,53.89 BAT1.1 | T2.3 47.54,62.47 48.19,63.12 R37.1
  Bottom 0.508: v26.47,22.61 26.47,21.5 C7.2
  Bottom 0.61: 26.47,21.5 26.47,20.7 27.23,19.94 27.23,18.93 v27.49,18.67
  Bottom 1.016: C6.2 31.39,21.12 v32.06,20.45 32.82,21.21 v32.82,25.02
IR_FL  (via drill 0.35)
  Top 0.254: STM32F405RGT6.4 34.95,6.77 37.01,4.7 37.01,2.67 37.9,1.78 v38.54,1.78
  Route15 0.254: J1.9 34.84,2.16 36.12,2.16 36.51,1.78 v38.54,1.78
IR_FR  (via drill 0.35)
  Top 0.254: STM32F405RGT6.6 35.22,7.77 37.93,5.06 37.93,3.53 38.16,3.3 v40.06,3.3
  Route15 0.254: J1.7 32.65,2.98 38.46,2.98 38.79,3.3 v40.06,3.3
IR_L  (via drill 0.35)
  Top 0.254: STM32F405RGT6.3 34.81,6.27 36.51,4.58 36.51,2.29 v37.77,1.02
  Route15 0.254: J1.10 35.57,1.02 v37.77,1.02
IR_R  (via drill 0.35)
  Top 0.254: STM32F405RGT6.5 35.02,7.27 37.52,4.77 37.52,3.18 38.16,2.54 v39.3,2.54
  Route15 0.254: J1.8 33.74,2.57 39.27,2.57 v39.3,2.54
LED_1  (via drill 0.2)
  Top 0.254: STM32F405RGT6.33 21.83,12.77 21.39,13.21 21.39,17.02 v22.54,18.16 | R24.1 8.69,64.18 v8.69,65.66 | v20.22,50.17 20.25,50.2 v20.25,54.99
  Route15 0.254: v8.69,65.66 9.71,65.66 11.36,67.31 12.88,67.31 13.77,66.42 13.77,65.66 15.68,63.76 15.68,61.6 16.69,60.58 18.22,60.58 20.22,58.58 20.25,58.54 v20.25,54.99 | v20.22,50.17 20.22,49.43 21.9,47.76 v21.9,45.85 | v23.17,35.69 23.42,35.44 23.42,29.09 25.71,26.8 25.71,20.64 23.07,18.01 22.69,18.01 v22.54,18.16
  Bottom 0.254: v21.9,45.85 22.66,46.61 25.71,46.61 27.11,45.22 27.11,41.28 26.37,40.54 24.21,40.54 23.17,39.5 v23.17,35.69
LED_2  (via drill 0.2)
  Top 0.254: STM32F405RGT6.34 21.57,12.27 20.99,12.86 20.99,17.63 v21.39,18.04 | R25.1 47.85,66.42 v45.01,66.42
  Route15 0.254: v45.01,66.42 43.49,64.9 41.33,64.9 40.82,64.39 40.82,61.98 40.19,61.34 27.11,61.34 25.07,59.31 25.07,57.03 22.66,54.61 21.14,54.61 19.64,53.11 19.64,50.13 17.9,48.39 17.33,48.39 16.57,47.63 16.57,44.27 19.77,41.06 19.77,34.14 22.08,31.82 v22.23,31.82 | v23.3,27.18 22.94,26.83 22.94,23.08 22.54,22.67 22.54,19.18 v21.39,18.04
  Bottom 0.254: v23.3,27.18 23.3,27.94 22.23,29.01 v22.23,31.82
LED_3  (via drill 0.2)
  Top 0.254: STM32F405RGT6.36 20.92,11.27 20.58,11.61 20.58,17.2 20.38,17.4 20.38,17.91 21.39,18.93 22.67,18.93 v23.76,20.02 | R26.1 12.88,67.82 11.99,66.93 11.99,66.55 v12.12,66.42 | v21.77,27.31 23.66,25.42 23.66,23.59 v23.68,23.57
  Route15 0.254: v12.12,66.42 12.12,66.3 14.91,63.5 14.91,61.34 16.44,59.82 17.84,59.82 19.23,58.42 19.23,50.93 15.68,47.37 15.68,44.58 19.36,40.9 19.36,33.28 22.03,30.61 22.03,27.56 v21.77,27.31 | v23.68,23.57 23.68,20.1 v23.76,20.02
LED_4  (via drill 0.2)
  Top 0.254: STM32F405RGT6.22 29.52,14.67 v29.52,13.46 | R27.1 43.2,67.15 41.97,65.92 41.46,65.92 v40.6,66.77
  Route2 0.254: v40.6,66.77 40.6,60.74 38.24,58.38 36.59,58.38 35.49,57.28 v33.33,57.28
  Route15 0.254: v33.33,57.28 33.33,50.23 32.92,49.83 32.92,36.62 27.92,31.61 27.92,31.13 28.25,30.8 28.25,28.32 29.39,27.18 33.58,27.18 34.73,26.04 34.73,19.31 35.36,18.67 35.36,17.27 34.36,16.27 33.32,16.27 33.3,16.26 31.04,16.26 30.54,15.75 30.54,14.23 29.77,13.46 v29.52,13.46
LED_5  (via drill 0.2)
  Top 0.254: STM32F405RGT6.45 20.63,6.77 20.3,7.1 v20.3,7.85 | v19.06,10.59 19.06,11.64 19.61,12.2 19.61,16.13 18.73,17.02 v18.6,17.02 | T6.1 31.11,53.02 29.14,51.06 v29.01,51.06
  Route15 0.254: v29.01,51.06 22.54,44.58 22.54,43.69 22.66,43.56 22.66,38.87 22.28,38.48 22.28,36.7 | v18.6,17.02 18.6,18.16 20.76,20.32 20.76,21.47 22.54,23.24 22.54,29.85 23.02,30.33 23.02,34.19 22.28,34.93 22.28,36.7 | 22.28,36.7
  Bottom 0.254: v19.06,10.59 19.06,9.58 19.74,8.89 19.74,8.23 20.12,7.85 v20.3,7.85
LED_6  (via drill 0.2)
  Top 0.254: STM32F405RGT6.44 21.24,7.27 20.88,7.62 20.88,8.13 20.5,8.51 20.38,8.51 20.25,8.64 20.25,9.4 20.45,9.6 v20.55,9.6 | v19.74,11.31 19.74,11.56 20.12,11.94 20.12,16.64 v19.49,17.27
  Route15 0.254: v34.47,18.67 33.71,19.43 25.07,19.43 22.92,17.27 v19.49,17.27
  Bottom 0.254: v20.55,9.6 19.74,10.41 v19.74,11.31 | T4.1 36.89,19.92 36.89,18.67 36.25,18.04 35.11,18.04 v34.47,18.67
LED_7  (via drill 0.2)
  Top 0.254: STM32F405RGT6.50 25,4.14 24.69,4.45 v23.8,4.45 | R19.1 15.68,15.12 16.31,14.48 v18.98,14.48
  Route2 0.254: v18.98,14.48 18.98,13.21 22.79,9.4 22.79,4.96 23.3,4.45 v23.8,4.45
MISO  (via drill 0.2, 0.35)
  Top 0.254: STM32F405RGT6.52 26,5.04 v26.04,5.08
  Route15 0.254: v26.04,5.08 26.93,5.97 27.49,5.97 27.87,6.35 v27.87,12.31
  Bottom 0.254: ICM20689.9 28,12.18 v27.87,12.31
MOSI  (via drill 0.35)
  Top 0.254: v26.09,6.61 26.73,5.97 26.73,4.7 26.5,4.48 STM32F405RGT6.53
  Bottom 0.254: ICM20689.24 27,6.75 26.85,6.61 v26.09,6.61
MOTOR_L_CCW
  Top 0.254: STM32F405RGT6.24 28.5,15.62 28.73,15.85 29.62,15.85 30.14,16.38 TB6612.22
MOTOR_L_CW
  Top 0.254: STM32F405RGT6.25 28,15.81 28.45,16.26 29.39,16.26 29.52,16.39 29.52,17.35 TB6612.21
MOTOR_L_OUT1  (via drill 0.35)
  Top 0.406: TB6612.1 TB6612.2
  Top 0.61: TB6612.1 31.44,25.89 v31.04,26.29
  Bottom 1.016: v31.04,26.29 35.87,26.29 37.01,27.44 37.01,29.09 39.13,31.21 C33.1 39.16,32.28 MOTOR_L.2
MOTOR_L_OUT2  (via drill 0.35)
  Top 0.406: TB6612.5 28.68,24.62 TB6612.6
  Top 0.813: v28.5,26.29 28.68,26.12 28.68,24.62
  Bottom 1.016: v28.5,26.29 29.77,27.56 34.85,27.56 35.62,28.32 35.62,29.47 37.43,31.28 C33.2 37.16,32.54 MOTOR_L.1
MOTOR_L_PWM
  Top 0.254: STM32F405RGT6.21 30,15.6 30.79,16.39 TB6612.23
MOTOR_R_CCW
  Top 0.254: STM32F405RGT6.29 26,15.79 26.24,16.03 TB6612.16
MOTOR_R_CW
  Top 0.254: STM32F405RGT6.27 27,15.86 26.89,15.96 TB6612.17
MOTOR_R_OUT1  (via drill 0.35)
  Top 0.406: TB6612.12 TB6612.11
  Top 0.61: v24.44,27.05 24.55,26.95 24.55,24.88 TB6612.12
  Top 1.016: v19.36,43.31 v21.01,43.31 | v24.57,42.6 24.69,42.47 24.69,38.36 v24.57,38.23 | v24.31,34.17 24.44,34.04 v24.44,27.05
  Bottom 1.016: MOTOR_R.1 18,47.1 C34.2 18,43.91 18.6,43.31 v19.36,43.31 | v21.01,43.31 23.86,43.31 v24.57,42.6 | v24.57,38.23 24.31,37.98 v24.31,34.17
MOTOR_R_OUT2  (via drill 0.35)
  Top 0.406: TB6612.8 26.98,24.62 TB6612.7
  Top 0.61: 26.98,24.62 26.98,26.04 v27.23,26.29
  Top 1.016: v24.73,44.58 25.96,43.35 25.96,38.18 27.23,36.91 v27.23,29.85
  Bottom 1.016: MOTOR_R.2 19.7,47.1 C34.1 v24.73,44.58 | v27.23,29.85 v27.23,26.29
MOTOR_R_PWM
  Top 0.254: STM32F405RGT6.30 25.5,15.92 25.59,16.02 TB6612.15
MOTOR_STBY
  Top 0.254: STM32F405RGT6.26 27.5,15.88 28.19,16.58 TB6612.19
N$13  (via drill 0.35)
  Top 0.305: STM32F405RGT6.47 21.19,5.77 v20.63,5.21
  Bottom 0.305: v20.63,5.21 20.67,5.17 C5.2
N$14  (via drill 0.35)
  Top 0.254: STM32F405RGT6.31 24.98,14.71 24.98,15.84 24.95,15.88
  Top 0.305: v23.42,14.86 23.42,15.24 24.19,16 24.82,16 24.95,15.88
  Bottom 0.305: v23.42,14.86 C12.2
N$15  (via drill 0.35)
  Top 0.254: STM32F405RGT6.28 26.47,14.66 26.47,13.84 26.1,13.46 25.33,13.46 25.2,13.34 25.2,12.23 v25.24,12.2
  Bottom 0.254: v25.24,12.2 25.11,12.07 24.69,12.07 24.44,11.81 24.44,10.89 R18.2
N$16
  Bottom 0.254: LED5-2.A 26.98,54.93 26.98,54.61 26.6,54.23 23.68,54.23 23.59,54.14 R29.2
N$17
  Bottom 0.254: LED5-3.A 30.92,55.12 30.92,54.49 30.79,54.36 28.76,54.36 28.63,54.23 28.63,53.51 R30.2
N$18
  Bottom 0.254: LED5-4.A 34.98,55.18 34.98,54.49 34.85,54.36 32.7,54.36 32.48,54.14 R31.2
N$19
  Bottom 0.254: R20.2 14.53,12.32 14.53,11.3 BOOT.1
N$20
  Bottom 0.254: C24.1 28.25,13.34 28.89,12.7 28.89,12.34 28.5,11.95 ICM20689.10
N$21
  Top 0.254: P-LED.A 55.55,19.82 54.79,19.05 R21.2
N$22  (via drill 0.35)
  Top 0.813: 22.02,61.24 20.52,61.24 20.38,61.09 18.09,61.09
  Top 1.016: T2.2 T2.PAD 51.46,57.28 v53.65,57.28 | v4.25,60.84 9.2,60.84 9.58,61.22 9.58,64.01 10.85,65.28 14.41,65.28 15.68,64.01 15.68,61.98 16.57,61.09 18.09,61.09 | 22.02,61.24 23.28,61.24 24.31,60.2 v24.31,59.57 | v28.19,59.5 28.7,60.01 30.73,60.01 v30.79,60.07
  Bottom 0.813: 31.95,61.24 40.21,61.24
  Bottom 1.016: FAN.2 2.36,56.62 | 2.36,56.62 C20.2 | 2.36,56.62 1.83,57.15 D3.A 1.83,60.07 2.6,60.84 v4.25,60.84 | v24.31,59.57 24.76,60.02 27.67,60.02 v28.19,59.5 | v53.65,57.28 53.4,57.03 47.94,57.03 47.43,57.53 47.43,64.52 46.66,65.28 42.35,65.28 41.2,64.14 41.2,62.23 40.21,61.24 | v30.79,60.07 31.95,61.24
N$23
  Top 1.016: D4.A 20.8,35.77 SPK1.- 21.77,33.36 T9.3
N$26  (via drill 0.2)
  Top 0.254: R33.2 17.16,20.16 17.58,20.58 21.39,20.58 v21.91,21.09
  Bottom 0.254: v21.91,21.09 22.65,21.84 LED6-2.A
N$27
  Top 0.254: LED1.A 3.71,63 R24.2
N$28
  Bottom 0.254: LED6-3.A 28.87,23.89 28.34,24.43 R34.2
N$29  (via drill 0.2)
  Top 0.254: R35.2 36.63,27.86 v36.63,25.53
  Bottom 0.254: v36.63,25.53 36.63,23.89 LED6-4.A
N$30
  Bottom 0.254: R42.2 51.53,25.62 52.28,24.87 POWER.1
N$31
  Top 0.254: R27.2 41.5,68.04 39.43,70.11 35.62,70.11 35.23,70.49 LED4.A
N$32
  Bottom 0.254: LED5-1.A 22.16,54.36 20.38,54.36 19.78,53.76 R28.2
N$33
  Top 0.254: LED7.A 17.43,17.49 R19.2
N$36
  Top 0.254: LED2.A 53.4,62.23 53.4,62.87 50.98,65.28 R25.2
N$38  (via drill 0.2)
  Route15 0.254: v27.36,22.41 28.55,22.41 29.77,23.62 32.95,23.62 33.08,23.75 33.08,24.13 33.84,24.89 v34.09,24.89
  Bottom 0.254: LED6-2.C 21.15,20.95 21.65,20.45 23.3,20.45 23.82,20.97 LED6-1.C 23.82,22.49 24.64,23.32 27.32,23.32 LED6-3.C 27.37,22.42 v27.36,22.41 | v34.09,24.89 35.11,23.88 LED6-4.C
  Bottom 0.61: LED6-4.C 35.12,22.93 T4.3
N$39  (via drill 0.2)
  Top 0.61: T6.3 34.09,52.79 34.09,53.47 33.33,54.23 32.57,54.23 32.31,54.49 v32.31,55.12
  Bottom 0.254: LED5-1.C 21.5,55.61 21.9,56.01 25.07,56.01 25.63,55.46 LED5-2.C 26.36,55.8 27.66,55.8 27.97,55.5 29.2,55.5 LED5-3.C 30.23,55.93 32.77,55.93 LED5-4.C
  Bottom 0.61: v32.31,55.12 33.42,55.12 LED5-4.C
N$41
  Top 0.254: R26.2 15.13,69.05 16.06,69.98 22.54,69.98 23.04,70.49 LED3.A
N$43  (via drill 0.2)
  Top 0.254: R32.2 21.52,19.56 23.04,21.09 v24.82,21.09
  Bottom 0.254: v24.82,21.09 25.32,21.58 LED6-1.A
PC_RX  (via drill 0.2, 0.35)
  Top 0.254: STM32F405RGT6.42 24.3,8.27 v24.82,7.75
  Top 0.305: v15.17,8.39 14.47,8.39 10.14,12.71 8.81,12.71 2.85,18.67 2.85,23.75 JP1.2
  Route15 0.305: v24.82,7.75 24.69,7.62 23.3,7.62 22.92,7.24 19.87,7.24 19.11,6.48 17.58,6.48 15.68,8.39 v15.17,8.39
PC_TX  (via drill 0.2, 0.35)
  Top 0.254: v24.17,6.87 24.05,6.87 23.93,6.99 23.93,7.37 23.53,7.77
  Top 0.305: STM32F405RGT6.43 23.53,7.77
  Route15 0.305: v24.17,6.87 24.01,6.71 20.12,6.71 19.26,5.84 17.07,5.84 v15.42,7.5 | JP1.4 1.71,22.61 2.47,22.61 2.98,22.1 2.98,19.43 4.12,18.29 v4.12,16
  Bottom 0.305: v15.42,7.5 14.15,7.5 13.14,8.51 11.36,8.51 8.44,11.43 8.44,12.2 8.69,12.45 8.69,12.83 5.52,16 v4.12,16
PUSH_IN_1  (via drill 0.2)
  Top 0.254: STM32F405RGT6.9 36.38,9.27 v36.63,9.02 | v18.34,9.78 15.8,9.78 11.74,13.85 10.6,13.85 9.2,15.24 v9.2,17.15
  Route2 0.254: v21.27,9.02 22.03,8.26 22.03,3.56 22.59,3 22.9,3 23.08,2.82 34.62,2.82 36.38,4.58 36.38,8.51 36.63,8.77 v36.63,9.02
  Route15 0.254: v21.27,9.02 19.23,9.02 18.47,9.78 v18.34,9.78
  Bottom 0.254: MODE.1 MODE.2 9.2,21.23 9.2,19.18 | 9.2,19.18 8.35,18.33 R17.2 | 9.2,19.18 v9.2,17.15
RESET  (via drill 0.2)
  Top 0.254: STM32F405RGT6.7 35.48,8.27 36.89,6.86 v37.01,6.86
  Bottom 0.254: RESET.2 RESET.1 47.55,16.84 47.55,15.5 47.34,15.28 C13.2 47.34,13.93 48.06,13.21 48.06,11.94 47.43,11.31 47.43,10.29 44.63,7.5 42.73,7.5 40.31,5.08 38.79,5.08 v37.01,6.86
SCK  (via drill 0.2)
  Top 0.254: STM32F405RGT6.51 25.5,4.66 25.33,4.83 v25.33,5.72
  Bottom 0.254: ICM20689.23 27.5,6.56 26.66,5.72 v25.33,5.72
SENSOR_FL  (via drill 0.35)
  Top 0.254: v42.35,5.59 39.6,5.59 39.22,5.97 39.22,9.61 36.06,12.77 STM32F405RGT6.16
  Route15 0.254: J1.4 29.62,4.45 37.65,4.45 38.79,5.59 v42.35,5.59
SENSOR_FR  (via drill 0.35)
  Top 0.254: STM32F405RGT6.14 35.91,11.77 38.41,9.27 38.41,4.45 38.79,4.07 v40.82,4.07
  Route15 0.254: J1.6 31.61,3.43 38.03,3.43 38.66,4.07 v40.82,4.07
SENSOR_L  (via drill 0.35)
  Top 0.254: STM32F405RGT6.17 32,15.44 32.31,15.75 33.46,15.75 v33.59,15.62 | v34.6,13.46 34.89,13.18 36.23,13.18 39.63,9.78 39.63,6.61 39.88,6.35 v43.11,6.35
  Route2 0.254: J1.3 26.09,2.42 38.16,2.42 42.09,6.35 v43.11,6.35
  Route15 0.254: v33.59,15.62 34.47,14.73 34.47,13.59 v34.6,13.46
SENSOR_R  (via drill 0.35)
  Top 0.254: v41.59,4.83 38.94,4.83 38.82,4.96 38.82,9.44 35.99,12.27 STM32F405RGT6.15
  Route15 0.254: J1.5 30.62,3.94 37.77,3.94 38.66,4.83 v41.59,4.83
SW-POWER  (via drill 0.2)
  Top 0.254: STM32F405RGT6.10 36.49,9.77 v36.63,9.91
  Route15 0.254: v42.35,9.02 46.79,13.46 50.09,13.46 v50.48,13.85
  Bottom 0.254: v36.63,9.91 37.65,8.89 37.65,6.99 39.15,5.49 40.09,5.49 42.35,7.75 v42.35,9.02 | v50.48,13.85 50.48,16.05 50.32,16.21 50.32,21.31 50.74,21.73 POWER.2
SWCL  (via drill 0.2)
  Top 0.254: STM32F405RGT6.49 24.5,2.76 24.44,2.7 23.65,2.7 23.04,3.3 23.04,4.45 22.92,4.58 22.03,4.58 21.65,4.19 21.65,3.94 21.65,3.43 20.76,2.54
  Top 0.305: 20.76,2.54 19.74,1.53 18.34,1.53 5.9,13.97 v5.9,14.35
  Route15 0.305: v5.9,14.35 5.9,14.61 6.66,15.37 6.66,20.7 4.88,22.48 JP1.3
SWDIO  (via drill 0.2)
  Top 0.305: STM32F405RGT6.46 20.55,6.27 v20.38,6.1
  Route15 0.305: v20.38,6.1 19.95,5.67 19.95,4.93 19.99,4.88 19.99,1.91 19.74,1.65 18.22,1.65 6.15,13.72 5.64,13.72 5.01,14.35 v5.01,15.24 5.01,19.05 JP1.5
VOL_CHECK  (via drill 0.2)
  Top 0.254: STM32F405RGT6.8 36.05,8.77 v37.06,7.75
  Route15 0.254: v37.06,7.75 38.03,8.71 38.03,10.93 36.63,12.32 36.63,18.66 | 36.63,18.66 | 36.63,18.66 36.63,23.88 35.62,24.89 35.62,27.18 34.35,28.45 33.71,28.45 31.68,30.48 31.68,32.39 v31.3,32.77
  Bottom 0.254: R22.1 31.64,36.54 30.79,35.69 | 30.79,35.69 30.79,34.84 R23.2 | v31.3,32.77 31.17,32.77 29.52,34.42 29.52,35.05 30.16,35.69 30.79,35.69

### Text on the board
tPlace: passion-v2-20250212